# EAGLE design SkyNetV3main-1 (EAGLE 7.1.0)

## Sheet 1 of 4: Controller
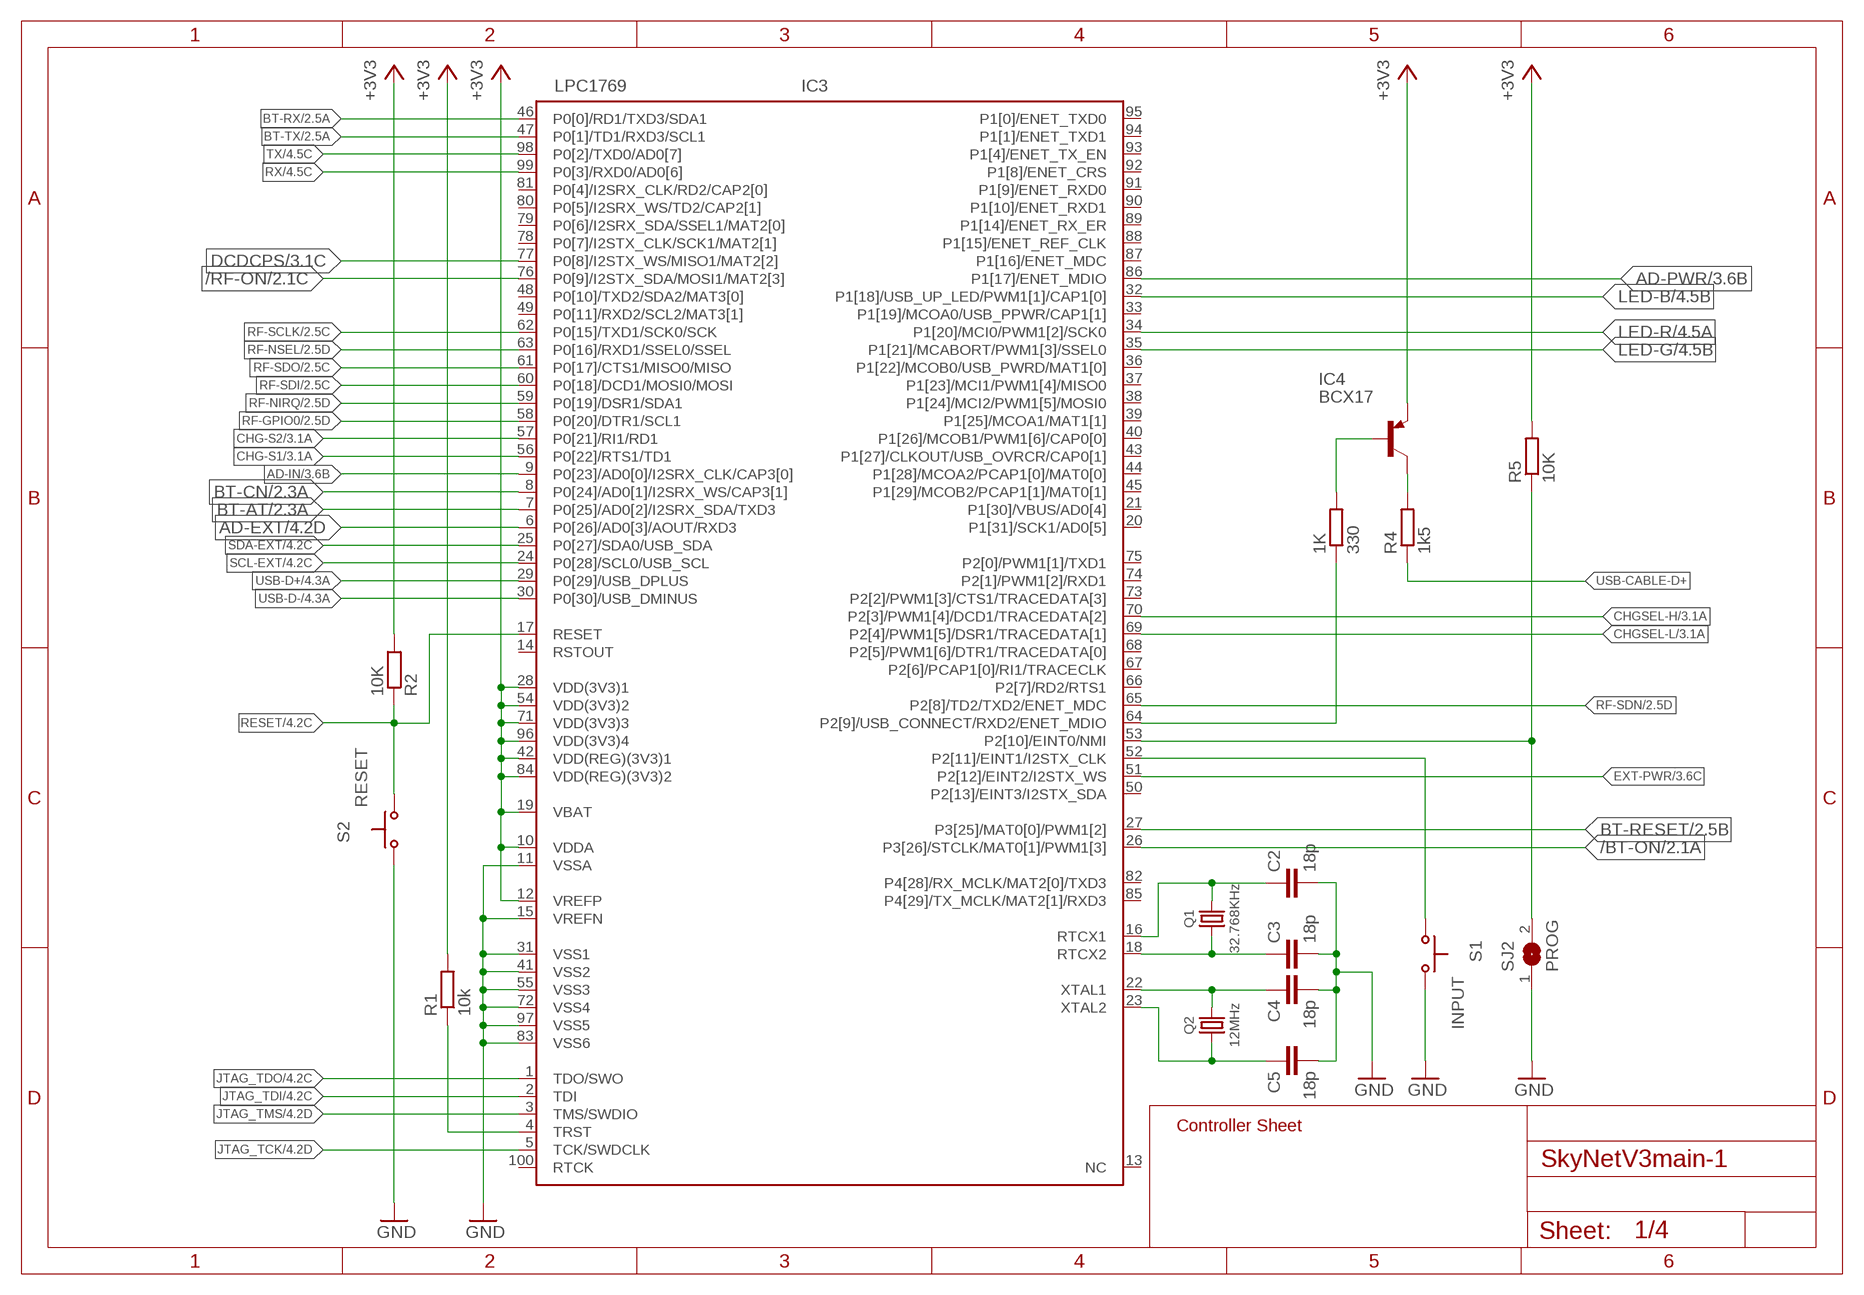
[diagram p0: schematic, sheet 1]

### Parts
1K  330  R-EU_R0603  [R0603]
C2  18p  C-EUC0603  [C0603]
C3  18p  C-EUC0603  [C0603]
C4  18p  C-EUC0603  [C0603]
C5  18p  C-EUC0603  [C0603]
IC3  LPC1769  LPC1768  [LQFP100-14X14]
IC4  BCX17  [SOT23]
Q1  32.768KHz  XTAL2-PAD  [XTAL_49_18]
Q2  12MHz  XTAL4-PAD  [XTAL_50_32]
R1  10k  R-EU_R0603  [R0603]
R2  10K  R-EU_R0603  [R0603]
R4  1k5  R-EU_R0603  [R0603]
R5  10K  R-EU_R0603  [R0603]
S1  INPUT  PTS645SSMTR  [PTS645-SMD]
S2  RESET  PTS645SSMTR  [PTS645-SMD]
SJ2  PROG  SJ  [SJ]

### Nets
+3V3: IC3.10(VDDA) IC3.12(VREFP) IC3.19(VBAT) IC3.28(VDD(3V3)1) IC3.42(VDD(REG)(3V3)1) IC3.54(VDD(3V3)2) IC3.71(VDD(3V3)3) IC3.84(VDD(REG)(3V3)2) IC3.96(VDD(3V3)4) IC4.2(E) R1.2 R2.2 R5.2 ; also sheet 2,3,4
/BT-ON: IC3.26(P3[26]/STCLK/MAT0[1]/PWM1[3]) ; also sheet 2
/RF-ON: IC3.76(P0[9]/I2STX_SDA/MOSI1/MAT2[3]) ; also sheet 2
AD-EXT: IC3.6(P0[26]/AD0[3]/AOUT/RXD3) ; also sheet 4
AD-IN: IC3.9(P0[23]/AD0[0]/I2SRX_CLK/CAP3[0]) ; also sheet 3
AD-PWR: IC3.86(P1[17]/ENET_MDIO) ; also sheet 3
BT-AT: IC3.7(P0[25]/AD0[2]/I2SRX_SDA/TXD3) ; also sheet 2
BT-CN: IC3.8(P0[24]/AD0[1]/I2SRX_WS/CAP3[1]) ; also sheet 2
BT-RESET: IC3.27(P3[25]/MAT0[0]/PWM1[2]) ; also sheet 2
BT-RX: IC3.46(P0[0]/RD1/TXD3/SDA1) ; also sheet 2
BT-TX: IC3.47(P0[1]/TD1/RXD3/SCL1) ; also sheet 2
CHG-S1: IC3.56(P0[22]/RTS1/TD1) ; also sheet 3
CHG-S2: IC3.57(P0[21]/RI1/RD1) ; also sheet 3
CHGSEL-H: IC3.70(P2[3]/PWM1[4]/DCD1/TRACEDATA[2]) ; also sheet 3
CHGSEL-L: IC3.69(P2[4]/PWM1[5]/DSR1/TRACEDATA[1]) ; also sheet 3
DCDCPS: IC3.77(P0[8]/I2STX_WS/MISO1/MAT2[2]) ; also sheet 3
EXT-PWR: IC3.51(P2[12]/EINT2/I2STX_WS) ; also sheet 3
GND: C2.2 C3.2 C4.2 C5.2 IC3.11(VSSA) IC3.15(VREFN) IC3.31(VSS1) IC3.41(VSS2) IC3.55(VSS3) IC3.72(VSS4) IC3.83(VSS6) IC3.97(VSS5) S1.3(S) S1.4(S) S2.1(P) S2.2(P) SJ2.1 ; also sheet 2,3,4
INPUT: IC3.52(P2[11]/EINT1/I2STX_CLK) S1.1(P) S1.2(P)
JTAG-TRST: IC3.4(TRST) R1.1
JTAG_TCK: IC3.5(TCK/SWDCLK) ; also sheet 4
JTAG_TDI: IC3.2(TDI) ; also sheet 4
JTAG_TDO: IC3.1(TDO/SWO) ; also sheet 4
JTAG_TMS: IC3.3(TMS/SWDIO) ; also sheet 4
LED-B: IC3.32(P1[18]/USB_UP_LED/PWM1[1]/CAP1[0]) ; also sheet 4
LED-G: IC3.35(P1[21]/MCABORT/PWM1[3]/SSEL0) ; also sheet 4
LED-R: IC3.34(P1[20]/MCI0/PWM1[2]/SCK0) ; also sheet 4
PROG: IC3.53(P2[10]/EINT0/NMI) R5.1 SJ2.2
RESET: IC3.17(RESET) R2.1 S2.3(S) S2.4(S) ; also sheet 4
RF-GPIO0: IC3.58(P0[20]/DTR1/SCL1) ; also sheet 2
RF-NIRQ: IC3.59(P0[19]/DSR1/SDA1) ; also sheet 2
RF-NSEL: IC3.63(P0[16]/RXD1/SSEL0/SSEL) ; also sheet 2
RF-SCLK: IC3.62(P0[15]/TXD1/SCK0/SCK) ; also sheet 2
RF-SDI: IC3.60(P0[18]/DCD1/MOSI0/MOSI) ; also sheet 2
RF-SDN: IC3.65(P2[8]/TD2/TXD2/ENET_MDC) ; also sheet 2
RF-SDO: IC3.61(P0[17]/CTS1/MISO0/MISO) ; also sheet 2
RTCX1: C2.1 IC3.16(RTCX1) Q1.2
RTCX2: C3.1 IC3.18(RTCX2) Q1.1
RX: IC3.99(P0[3]/RXD0/AD0[6]) ; also sheet 4
SCL-EXT: IC3.24(P0[28]/SCL0/USB_SCL) ; also sheet 4
SDA-EXT: IC3.25(P0[27]/SDA0/USB_SDA) ; also sheet 4
TX: IC3.98(P0[2]/TXD0/AD0[7]) ; also sheet 4
USB-CABLE-D+: R4.1 ; also sheet 4
USB-CON: 1K.1 IC3.64(P2[9]/USB_CONNECT/RXD2/ENET_MDIO)
USB-CON-TRANS: 1K.2 IC4.1(B)
USB-CON-TRANS-2: IC4.3(C) R4.2
USB-D+: IC3.29(P0[29]/USB_DPLUS) ; also sheet 4
USB-D-: IC3.30(P0[30]/USB_DMINUS) ; also sheet 4
XTAL1: C4.1 IC3.22(XTAL1) Q2.3
XTAL2: C5.1 IC3.23(XTAL2) Q2.1
Unconnected: IC3.13(NC) IC3.14(RSTOUT) IC3.20(P1[31]/SCK1/AD0[5]) IC3.21(P1[30]/VBUS/AD0[4]) IC3.33(P1[19]/MCOA0/USB_PPWR/CAP1[1]) IC3.36(P1[22]/MCOB0/USB_PWRD/MAT1[0]) IC3.37(P1[23]/MCI1/PWM1[4]/MISO0) IC3.38(P1[24]/MCI2/PWM1[5]/MOSI0) IC3.39(P1[25]/MCOA1/MAT1[1]) IC3.40(P1[26]/MCOB1/PWM1[6]/CAP0[0]) IC3.43(P1[27]/CLKOUT/USB_OVRCR/CAP0[1]) IC3.44(P1[28]/MCOA2/PCAP1[0]/MAT0[0]) IC3.45(P1[29]/MCOB2/PCAP1[1]/MAT0[1]) IC3.48(P0[10]/TXD2/SDA2/MAT3[0]) IC3.49(P0[11]/RXD2/SCL2/MAT3[1]) IC3.50(P2[13]/EINT3/I2STX_SDA) IC3.66(P2[7]/RD2/RTS1) IC3.67(P2[6]/PCAP1[0]/RI1/TRACECLK) IC3.68(P2[5]/PWM1[6]/DTR1/TRACEDATA[0]) IC3.73(P2[2]/PWM1[3]/CTS1/TRACEDATA[3]) IC3.74(P2[1]/PWM1[2]/RXD1) IC3.75(P2[0]/PWM1[1]/TXD1) IC3.78(P0[7]/I2STX_CLK/SCK1/MAT2[1]) IC3.79(P0[6]/I2SRX_SDA/SSEL1/MAT2[0]) IC3.80(P0[5]/I2SRX_WS/TD2/CAP2[1]) IC3.81(P0[4]/I2SRX_CLK/RD2/CAP2[0]) IC3.82(P4[28]/RX_MCLK/MAT2[0]/TXD3) IC3.85(P4[29]/TX_MCLK/MAT2[1]/RXD3) IC3.87(P1[16]/ENET_MDC) IC3.88(P1[15]/ENET_REF_CLK) IC3.89(P1[14]/ENET_RX_ER) IC3.90(P1[10]/ENET_RXD1) IC3.91(P1[9]/ENET_RXD0) IC3.92(P1[8]/ENET_CRS) IC3.93(P1[4]/ENET_TX_EN) IC3.94(P1[1]/ENET_TXD1) IC3.95(P1[0]/ENET_TXD0) IC3.100(RTCK)

### Notes on the sheet
- Controller Sheet

## Sheet 2 of 4: Radio
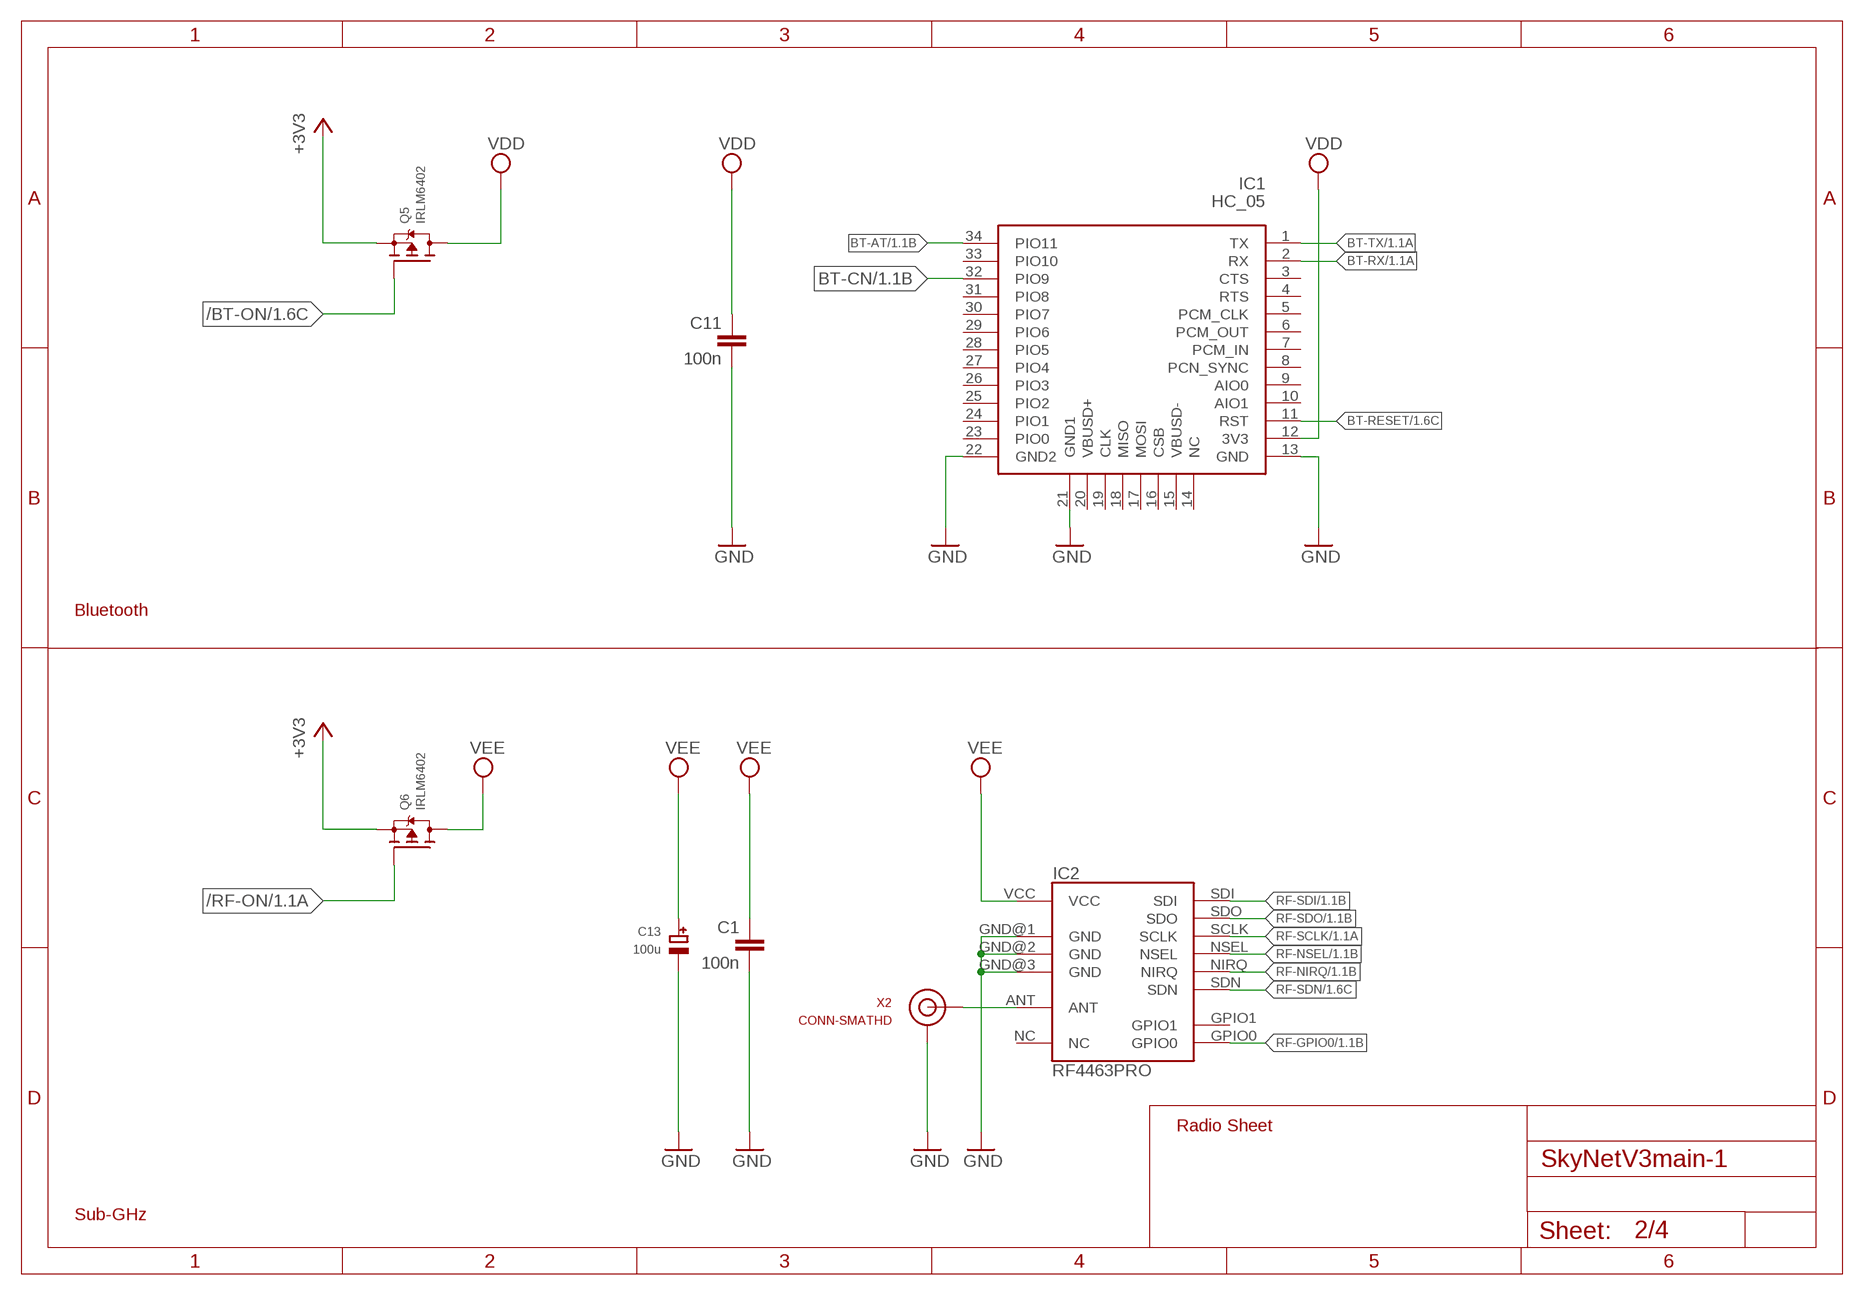
[diagram p1: schematic, sheet 2]

### Parts
C1  100n  C-EUC1206K  [C1206K]
C11  100n  C-EUC1206K  [C1206K]
C13  100u  CAP_TANTALUMC/6032_WAVE  [EIA6032-28/C-W]
IC1  HC_05  [BLUETOOTH_SMD]
IC2  RF4463PRO  [STD_BOARD]
Q5  IRLM6402  MOSFET-PWIDE  [SOT23-WIDE]
Q6  IRLM6402  MOSFET-PWIDE  [SOT23-WIDE]
X2  CONN-SMATHD  [SMA-THD]

### Nets
+3V3: Q5.2(S) Q6.2(S) ; also sheet 1,3,4
/BT-ON: Q5.1(G) ; also sheet 1
/RF-ON: Q6.1(G) ; also sheet 1
ANT: IC2.ANT X2.SIG(SIGNAL)
BT-AT: IC1.34(PIO11) ; also sheet 1
BT-CN: IC1.32(PIO9) ; also sheet 1
BT-RESET: IC1.11(RST) ; also sheet 1
BT-RX: IC1.2(RX) ; also sheet 1
BT-TX: IC1.1(TX) ; also sheet 1
GND: C1.2 C11.2 C13.- IC1.13(GND) IC1.21(GND1) IC1.22(GND2) IC2.GND@1(GND) IC2.GND@2(GND) IC2.GND@3(GND) X2.GND@0(GND) X2.GND@1(GND) X2.GND@2(GND) X2.GND@3(GND) ; also sheet 1,3,4
RF-GPIO0: IC2.GPIO0 ; also sheet 1
RF-NIRQ: IC2.NIRQ ; also sheet 1
RF-NSEL: IC2.NSEL ; also sheet 1
RF-SCLK: IC2.SCLK ; also sheet 1
RF-SDI: IC2.SDI ; also sheet 1
RF-SDN: IC2.SDN ; also sheet 1
RF-SDO: IC2.SDO ; also sheet 1
VDD: C11.1 IC1.12(3V3) Q5.3(D)
VEE: C1.1 C13.+ IC2.VCC Q6.3(D)
Unconnected: IC1.3(CTS) IC1.4(RTS) IC1.5(PCM_CLK) IC1.6(PCM_OUT) IC1.7(PCM_IN) IC1.8(PCN_SYNC) IC1.9(AIO0) IC1.10(AIO1) IC1.14(NC) IC1.15(VBUSD-) IC1.16(CSB) IC1.17(MOSI) IC1.18(MISO) IC1.19(CLK) IC1.20(VBUSD+) IC1.23(PIO0) IC1.24(PIO1) IC1.25(PIO2) IC1.26(PIO3) IC1.27(PIO4) IC1.28(PIO5) IC1.29(PIO6) IC1.30(PIO7) IC1.31(PIO8) IC1.33(PIO10) IC2.GPIO1 IC2.NC

### Notes on the sheet
- Bluetooth
- Radio Sheet
- Sub-GHz

## Sheet 3 of 4: Power
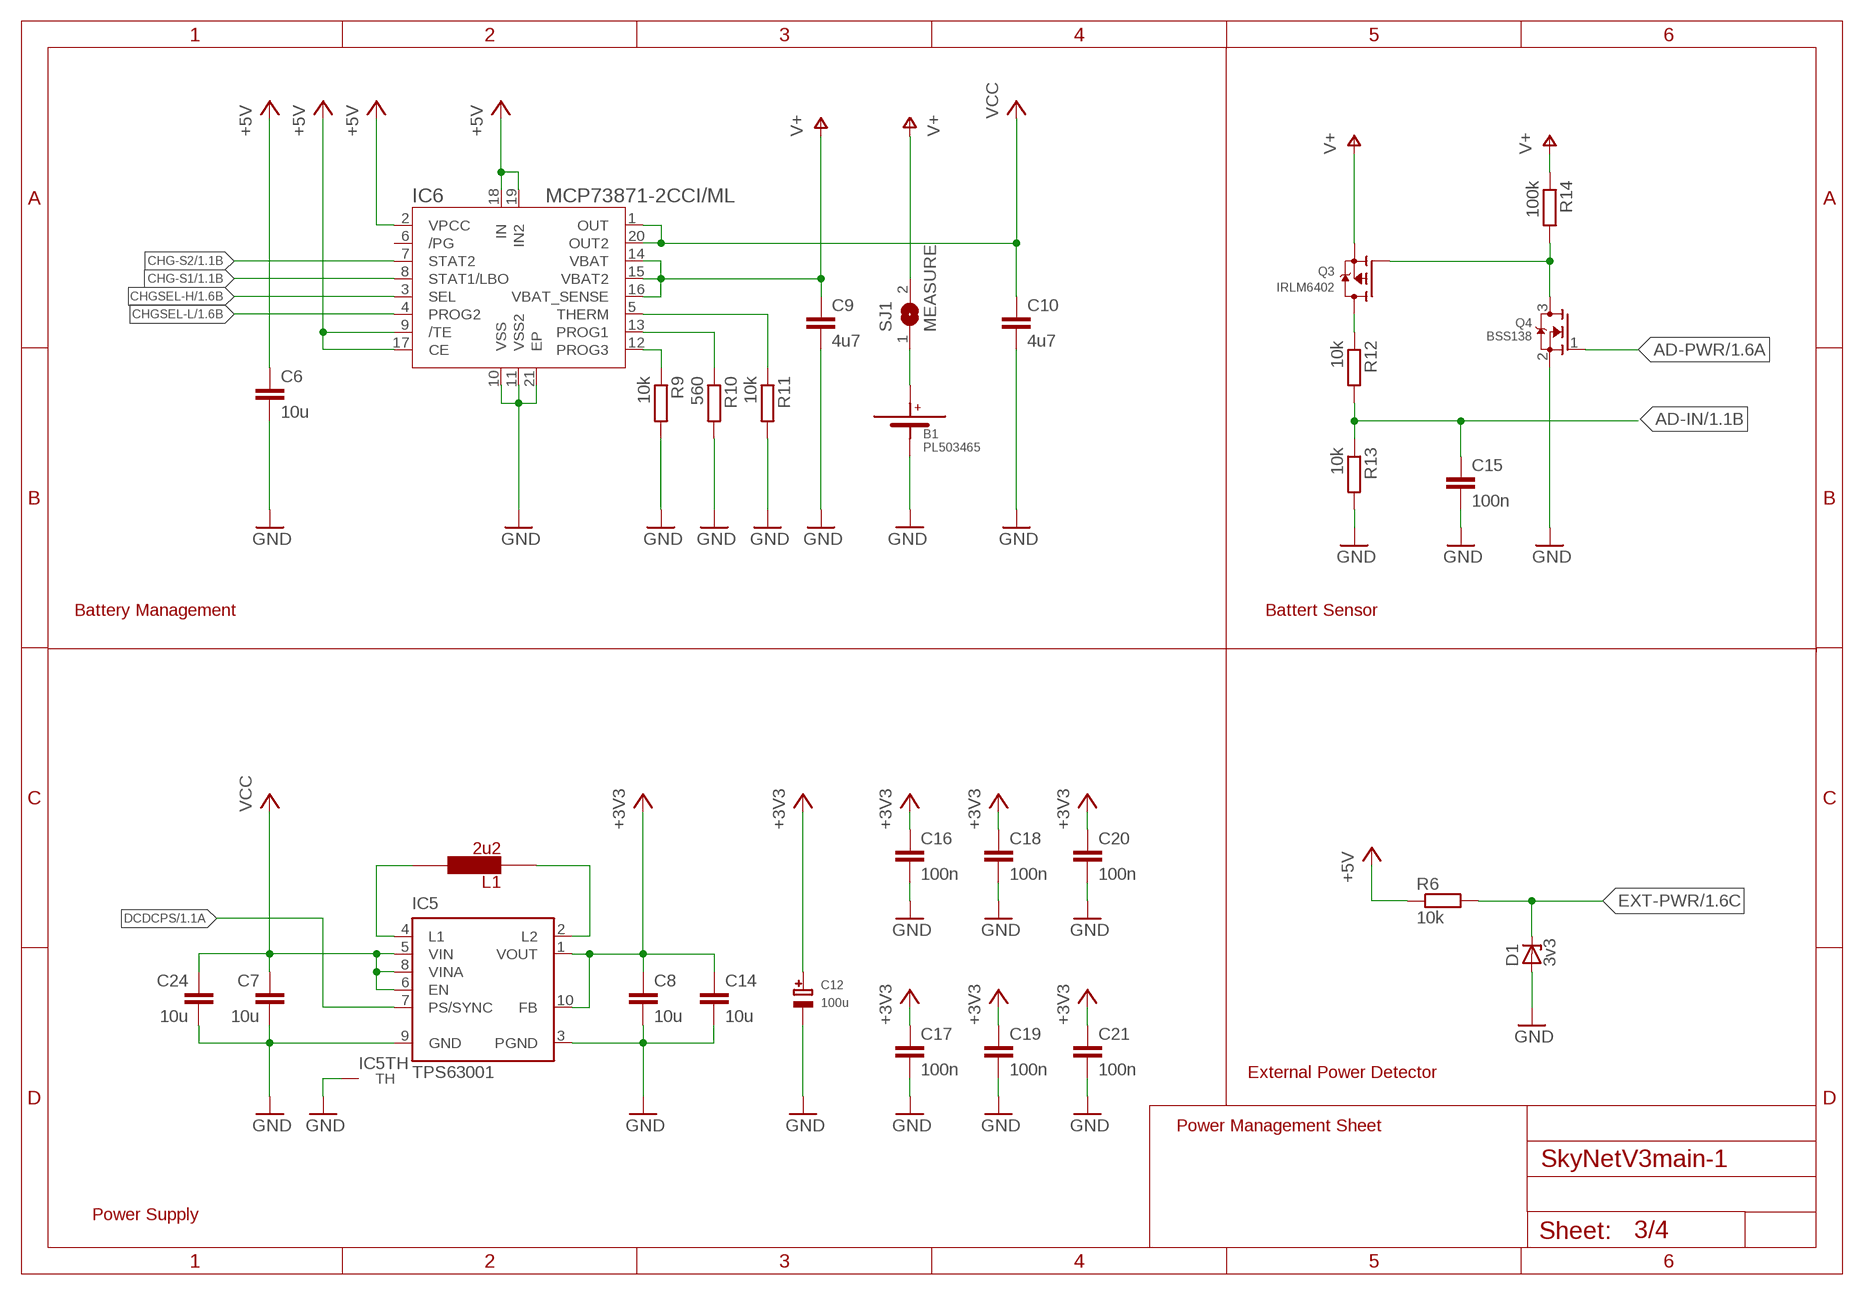
[diagram p2: schematic, sheet 3]

### Parts
B1  PL503465  1S  [PL503465]
C6  10u  C-EUC1206K  [C1206K]
C7  10u  C-EUC1206K  [C1206K]
C8  10u  C-EUC1206K  [C1206K]
C9  4u7  C-EUC1206K  [C1206K]
C10  4u7  C-EUC1206K  [C1206K]
C12  100u  CAP_TANTALUMC/6032_WAVE  [EIA6032-28/C-W]
C14  10u  C-EUC1206K  [C1206K]
C15  100n  C-EUC0603  [C0603]
C16  100n  C-EUC0603  [C0603]
C17  100n  C-EUC0603  [C0603]
C18  100n  C-EUC0603  [C0603]
C19  100n  C-EUC0603  [C0603]
C20  100n  C-EUC0603  [C0603]
C21  100n  C-EUC0603  [C0603]
C24  10u  C-EUC1206K  [C1206K]
D1  3v3  ZENER-DIODESOT23  [SOT23]
IC5  TPS63001  TPS6300  [DRC-S-PVSON-N10]
IC6  MCP73871-2CCI/ML  [QFN20-4X4]
L1  2u2  LPS4012  [LPS4012]
Q3  IRLM6402  MOSFET-PWIDE  [SOT23-WIDE]
Q4  BSS138  MOSFET-NWIDE  [SOT23-WIDE]
R6  10k  R-EU_R0603  [R0603]
R9  10k  R-EU_R0603  [R0603]
R10  560  R-EU_R0603  [R0603]
R11  10k  R-EU_R0603  [R0603]
R12  10k  R-EU_R0603  [R0603]
R13  10k  R-EU_R0603  [R0603]
R14  100k  R-EU_R0603  [R0603]
SJ1  MEASURE  SJ  [SJ]

### Nets
+3V3: C8.1 C12.+ C14.1 C16.1 C17.1 C18.1 C19.1 C20.1 C21.1 IC5.1(VOUT) IC5.10(FB) ; also sheet 1,2,4
+5V: C6.1 IC6.2(VPCC) IC6.9(/TE) IC6.17(CE) IC6.18(IN) IC6.19(IN2) R6.1 ; also sheet 4
AD-IN: C15.1 R12.2 R13.1 ; also sheet 1
AD-PWR: Q4.1(G) ; also sheet 1
AD-PWR-FET: Q3.1(G) Q4.3(D) R14.2
AD-PWR-FET2: Q3.3(D) R12.1
CHG-S1: IC6.8(STAT1/LBO) ; also sheet 1
CHG-S2: IC6.7(STAT2) ; also sheet 1
CHGSEL-H: IC6.3(SEL) ; also sheet 1
CHGSEL-L: IC6.4(PROG2) ; also sheet 1
DCDCPS: IC5.7(PS/SYNC) ; also sheet 1
EXT-PWR: D1.3(C) R6.2 ; also sheet 1
GND: B1.P- C6.2 C7.2 C8.2 C9.2 C10.2 C12.- C14.2 C15.2 C16.2 C17.2 C18.2 C19.2 C20.2 C21.2 C24.2 D1.1(A) IC5.3(PGND) IC5.9(GND) IC5.TH IC6.10(VSS) IC6.11(VSS2) IC6.21(EP) Q4.2(S) R9.2 R10.2 R11.2 R13.2 ; also sheet 1,2,4
L1: IC5.4(L1) L1.1
L2: IC5.2(L2) L1.2
N$2: B1.P+ SJ1.1
PROG1: IC6.13(PROG1) R10.1
PROG3: IC6.12(PROG3) R9.1
THERM: IC6.5(THERM) R11.1
V+: C9.1 IC6.14(VBAT) IC6.15(VBAT2) IC6.16(VBAT_SENSE) Q3.2(S) R14.1 SJ1.2
VCC: C7.1 C10.1 C24.1 IC5.5(VIN) IC5.6(EN) IC5.8(VINA) IC6.1(OUT) IC6.20(OUT2)
Unconnected: IC6.6(/PG)

### Notes on the sheet
- Battery Management | Battert Sensor
- External Power Detector
- Power Management Sheet
- Power Supply

## Sheet 4 of 4: Interface
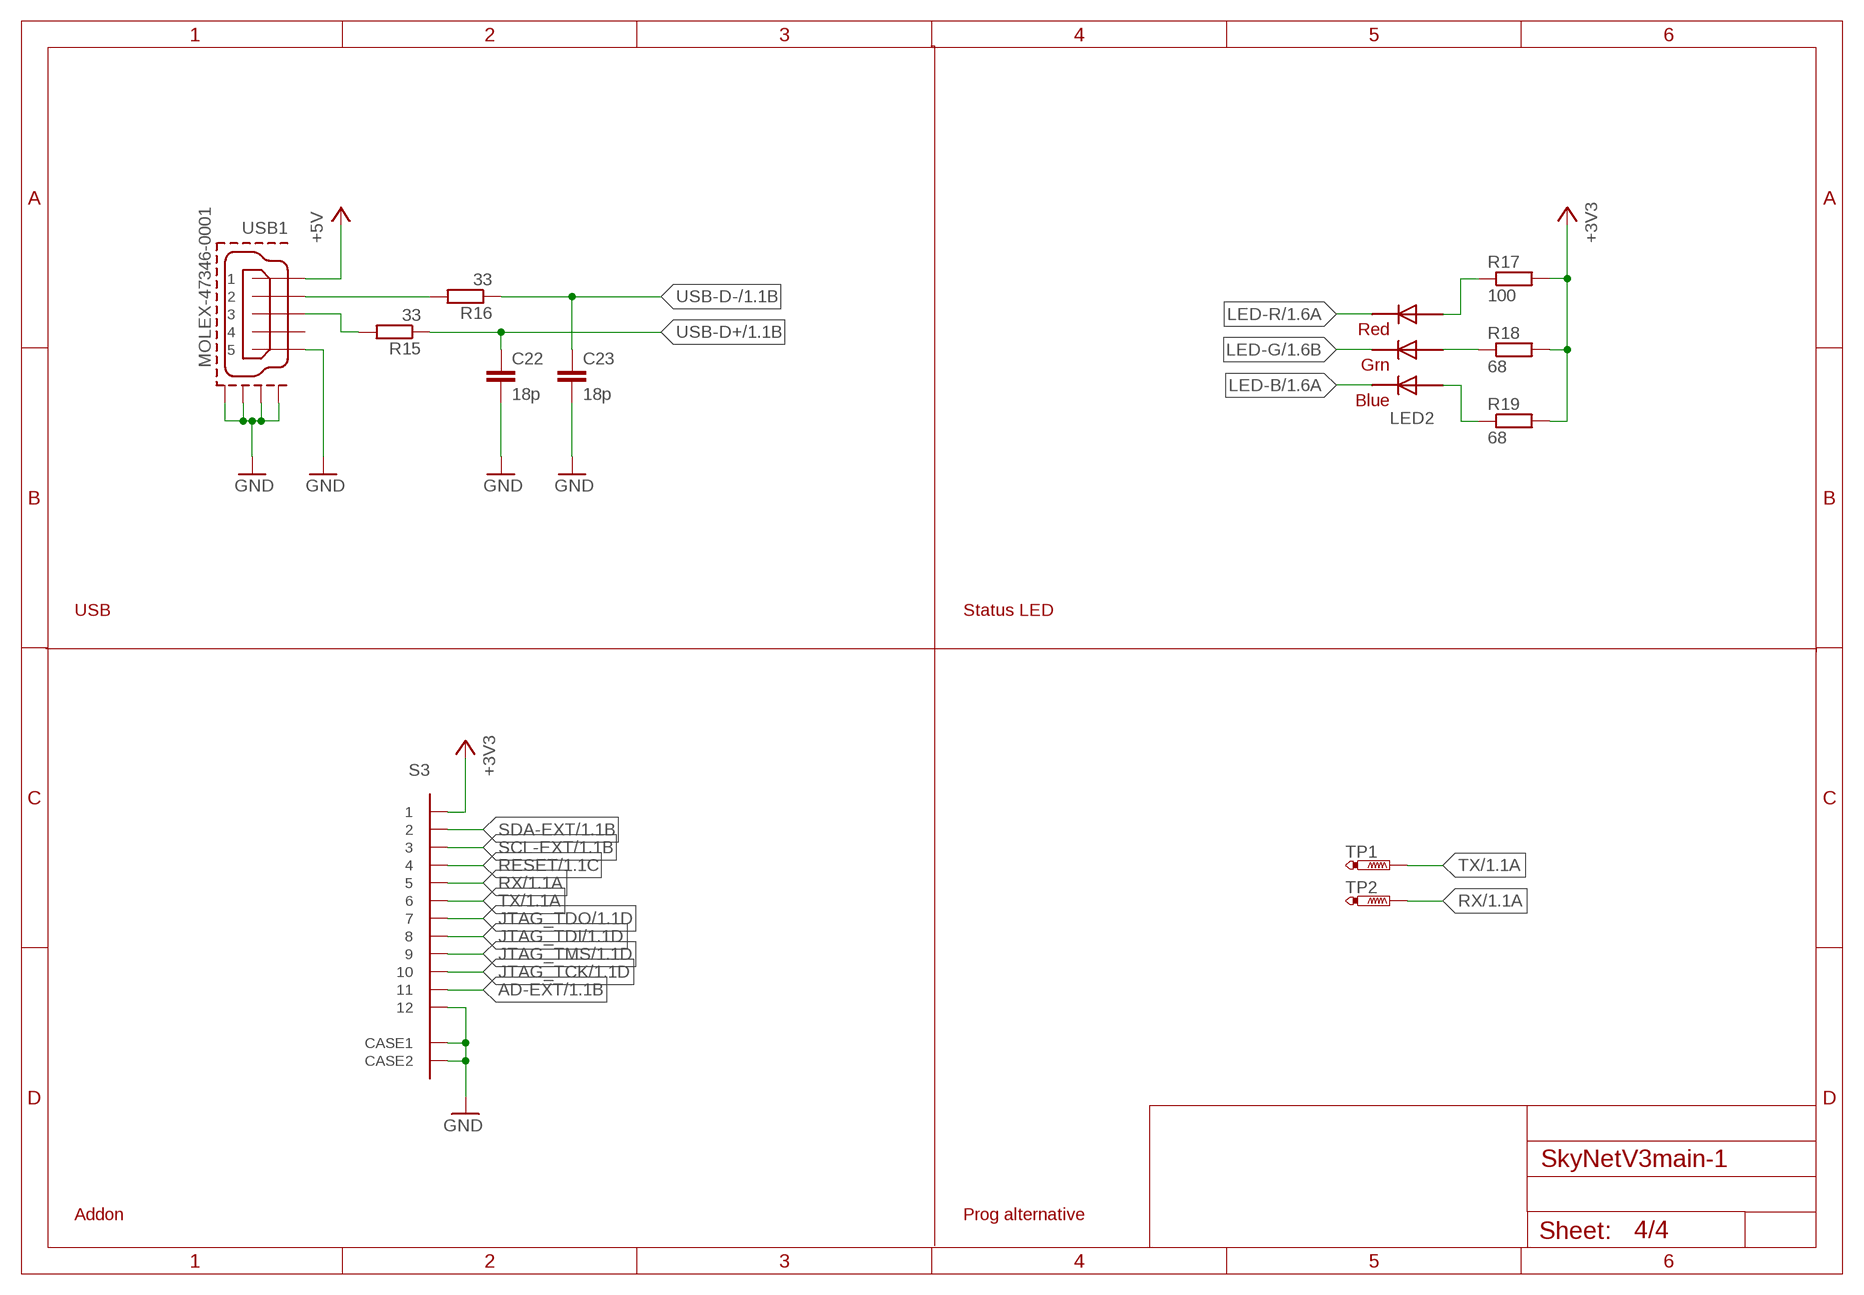
[diagram p3: schematic, sheet 4]

### Parts
C22  18p  C-EUC0603  [C0603]
C23  18p  C-EUC0603  [C0603]
LED2  RGBLED5050  [RGBLED5050]
R15  33  R-EU_R0603  [R0603]
R16  33  R-EU_R0603  [R0603]
R17  100  R-EU_R0603  [R0603]
R18  68  R-EU_R0603  [R0603]
R19  68  R-EU_R0603  [R0603]
S3  MOLEX-52892-1233  [MOLEX-52892-1233]
TP1  PTR1B1,27  [B1,27]
TP2  PTR1B1,27  [B1,27]
USB1  MOLEX-47346-0001  [MOLEX-47364-0001]

### Nets
+3V3: R17.2 R18.2 R19.2 S3.P$1 ; also sheet 1,2,3
+5V: USB1.1 ; also sheet 3
AD-EXT: S3.P$11 ; also sheet 1
GND: C22.2 C23.2 S3.P$12 S3.P$GND1(CASE1) S3.P$GND2(CASE2) USB1.5 USB1.GND1 USB1.GND2 USB1.GND3 USB1.GND4 ; also sheet 1,2,3
JTAG_TCK: S3.P$10 ; also sheet 1
JTAG_TDI: S3.P$8 ; also sheet 1
JTAG_TDO: S3.P$7 ; also sheet 1
JTAG_TMS: S3.P$9 ; also sheet 1
LED-B: LED2.4(BLUE_C) ; also sheet 1
LED-B-R: LED2.3(BLUE_A) R19.1
LED-G: LED2.6(GREEN_C) ; also sheet 1
LED-G-R: LED2.1(GREEN_A) R18.1
LED-R: LED2.5(RED_C) ; also sheet 1
LED-R-R: LED2.2(RED_A) R17.1
RESET: S3.P$4 ; also sheet 1
RX: S3.P$5 TP2.TP ; also sheet 1
SCL-EXT: S3.P$3 ; also sheet 1
SDA-EXT: S3.P$2 ; also sheet 1
TX: S3.P$6 TP1.TP ; also sheet 1
USB-CABLE-D+: R15.2 USB1.3 ; also sheet 1
USB-CABLE-D-: R16.2 USB1.2
USB-D+: C22.1 R15.1 ; also sheet 1
USB-D-: C23.1 R16.1 ; also sheet 1
Unconnected: USB1.4

### Notes on the sheet
- USB | Status LED
- Addon | Prog alternative

## Library data of the parts
1K R1 R2 R4-R6 R9-R19 = rcl:R-EU_: RESISTOR, European symbol
B1 = i7:1S
C1-C11 C14-C24 = rcl:C-EU: CAPACITOR, European symbol
C12 C13 = microbuilder:CAP_TANTALUM: Tantalum Capacitors Wave footprints have larger pads and are meant to be used for hand soldering. Reflow footprints are optimised for solder paste and a reflow oven. EIA3216-18/A-[R/W] - Size A / 3216-18 / 1206 footprint 4.7µF 25V 10% Tantalum Capacitor 10µF 16V 10% Tantalum Capacitor [Digikey: 495-2236-2-ND] EIA3528-21/B-[R/W] - Size B / 3528-21 47µF 10V 10% Tantalum Capactior [Digikey: 495-2216-1-ND] EIA6032-28/C-[R/W] - Size C / 6032-28 10µF 35V 20% Tantalum Capacitor [Digikey: 495-2285-1-ND] 100µF 16V 10% Tantalum Capactior [Digikey: 399-5214-1-ND]
D1 = diode:ZENER-DIODE: Z-Diode
IC1 = Bluetooth HC-05:HC_05: HC-05 Bluetooth Module
IC2 = RF4436PRO:RF4463PRO: RF4463PRO module with Si4463 chipset.
IC3 = lpc1xxx-v6:LPC1768: LPC1768 100 MHz 32-bit ARM Cortex-M3 based microcontroller featuring a high level of integration and low power consumption. 512 kB Flash, 64 kB SRAM, USB Device/Host/OTG, 2 CAN, DAC, Ethernet MarcVl - Datasheet available on www.nxp.com
IC4 = skynet_other:BCX17
IC5 = texas:TPS6300*: HIGH EFFICIENT SINGLE INDUCTOR BUCK-BOOST CONVERTER WITH 1.8-A SWITCHES Source: http://focus.ti.com/lit/ds/symlink/tps63001.pdf; MPN: TPS63000DRCTG4; OC_FARNELL: 1511852; OC_NEWARK: 59M7217
IC6 = microchip-battery:MCP73871: Stand-Alone System Load Sharing and Li-Ion / Li-Polymer Battery Charge Managemen The MCP73871 device is a 1A fully integrated linear solution for system load sharing and Li-Ion / Li-Polymer battery charge management with AC-DC wall adapter and USB port power sources selection. It?s also capable of autonomous power source selection between input or battery. The MCP73871 device employs a constant current/constant voltage (CC/CV) charge algorithm with selectable charge termination point. The constant voltage regulation is fixed with four available options: 4.10V, 4.20V, 4.35V, or 4.40V.; LBO: 3.1 V; SAFETYTIMER: 6 Hours; VREG: 4.20V
L1 = skynet_other:LPS4012
LED2 = adafruit:RGBLED: For 5050 RGB LEDs, the order of the LEDs may vary from one manufacturer to another!
Q1 Q2 = skynet_other:XTAL
Q3 Q5 Q6 = microbuilder:MOSFET-P: P-Channel Mosfet LEGEND VDS: Voltage Drain-Source ID: Drain Current RDS(ON): Drain-Source On-State Resistance VGS(TH): Gate-Source Threshold Voltage CISS: Drain-Source Input Capacitance SOT-23 Name VDS ID RDS(ON) VGS(TH) CISS Order Number IRLML5103 30V 760mA 600 mOhm -- 75pF @ 25V Digikey: IRLML5103PBFCT-ND IRLML6401 12V 4.3A 50 mOhm 950mV @ 250µA 830pF @ 10V Digikey: IRLML6401PBFTR-ND NTR0202PL 20V 400mA 800 mOhm 2.3V @ 250uA 70pF @ 5V Digikey: NTR0202PLT1GOSTR-ND NTR4101PT1G 20V 1.8A 85 mOhm 1.2V @ 250uA 675pF @ 10V Digikey: NTR4101PT1GOSCT-ND DMP2004K 20V 600mA 900 mOhm 1V @ 250uA 175pF @ 16V Digikey: DMP2004KDICT-ND PMV65XP 20V 3.9A 76 mOhm 950mV @ 1mA 725pF @ 20V Digikey: 568-2358-2-ND TO-252 Name VDS ID RDS(ON) VGS(TH) CISS Order Number AOD417 30V 25A 34 mOhm 3V @ 250µA 920pF @ 15V Digikey: 785-1106-2-ND
Q4 = microbuilder:MOSFET-N: N-Channel Mosfet LEGEND VDS: Voltage Drain-Source ID: Drain Current RDS(ON): Drain-Source On-State Resistance VGS(TH): Gate-Source Threshold Voltage CISS: Drain-Source Input Capacitance SOT-23 Name VDS ID RDS(ON) VGS(TH) CISS Order Number 2N7002E 60V 260mA 2.5 Ohm 2.5V @ 250uA 26.7pF @ 25V 2N7002ET1GOSTR-ND BSH103 30V 850mA 400 mOhm 400mV @ 1mA 83pF @ 24V BSH103,235-ND BSS138 60V 320mA 1.6 Ohm 1.5V @ 250uA 50pF @ 10V Mouser: 771-BSS138PW115 DMN2075U-7 20V 4.2A 38 mOhm 1V @ 250 uA 594.3pF @ 10V DMN2075U-7DICT-ND * BSS138 good choice for I2C level-shifting
S1 S2 = switch-ck:PTS645S???SMTR: TACT SWITCH
S3 = sid:MOLEX-52892-1233
SJ1 SJ2 = jumper:SJ: SMD solder JUMPER
TP1 TP2 = testpad:PTR1: TEST PIN
USB1 = usb_con-update:MOLEX-47346-0001: MICRO USB B, BOTTOM MOUNT
X2 = SteveMarple:CONN-SMA: SMA connector

## Board
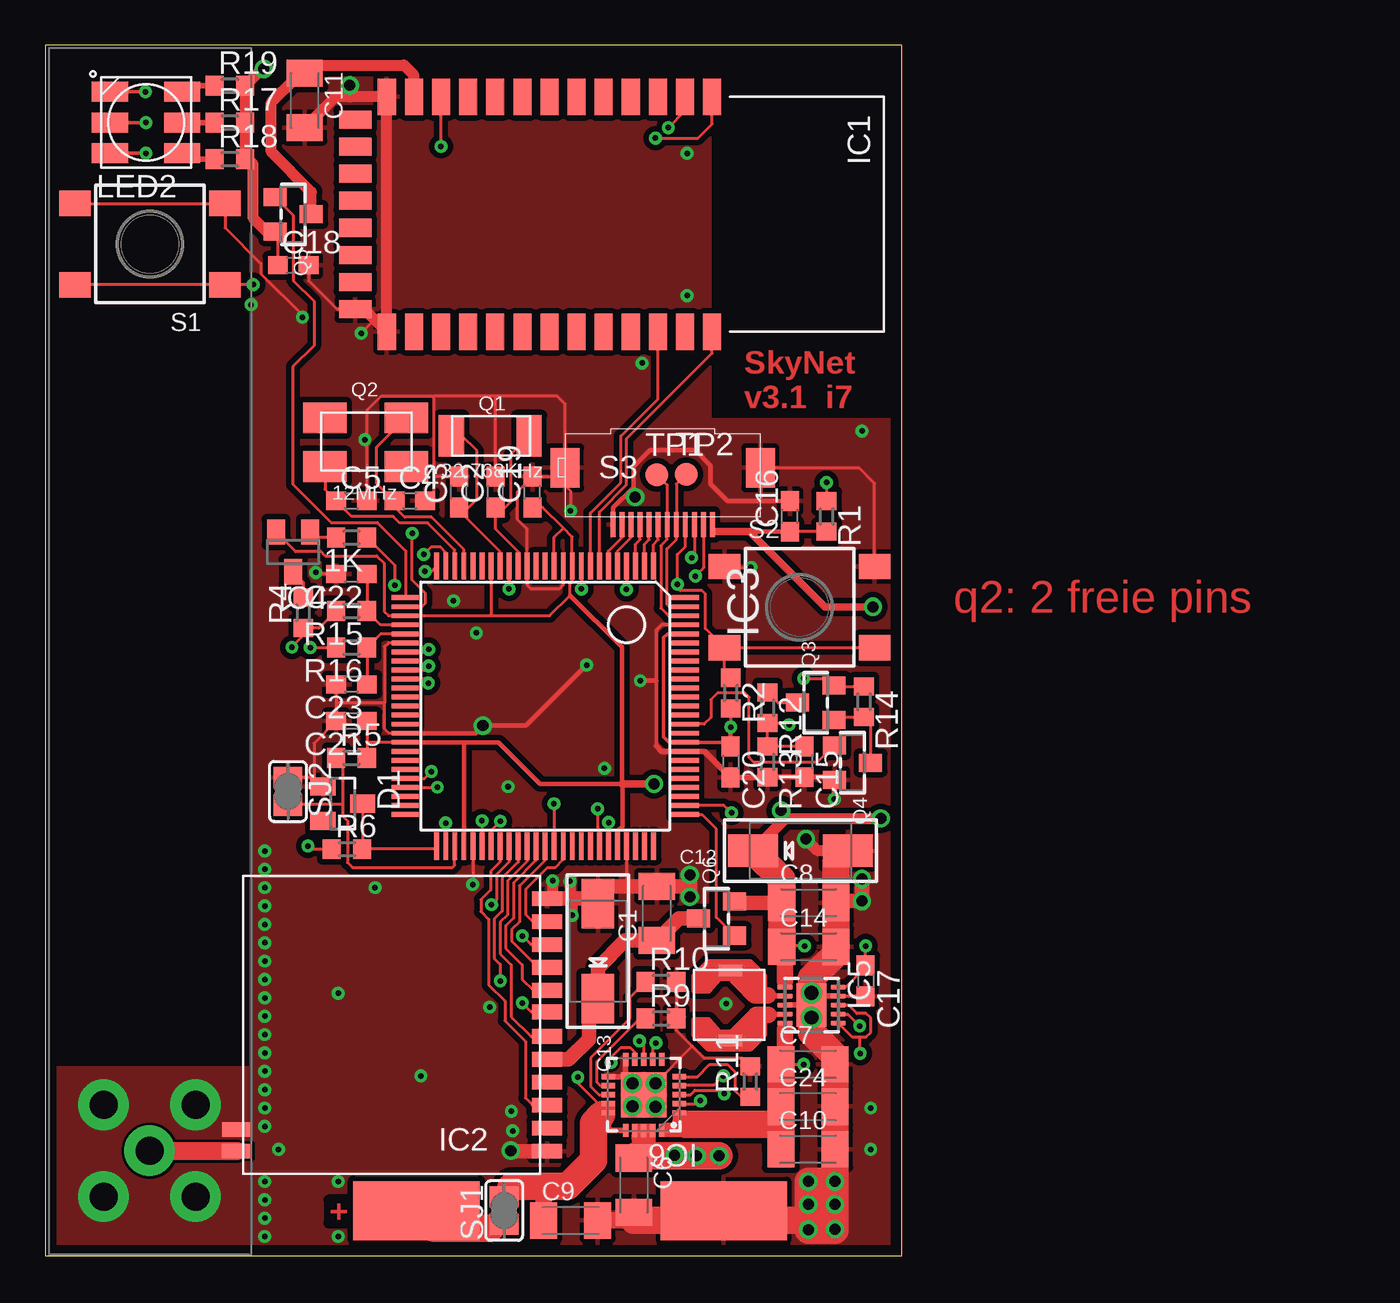
[diagram p4: board, top side]
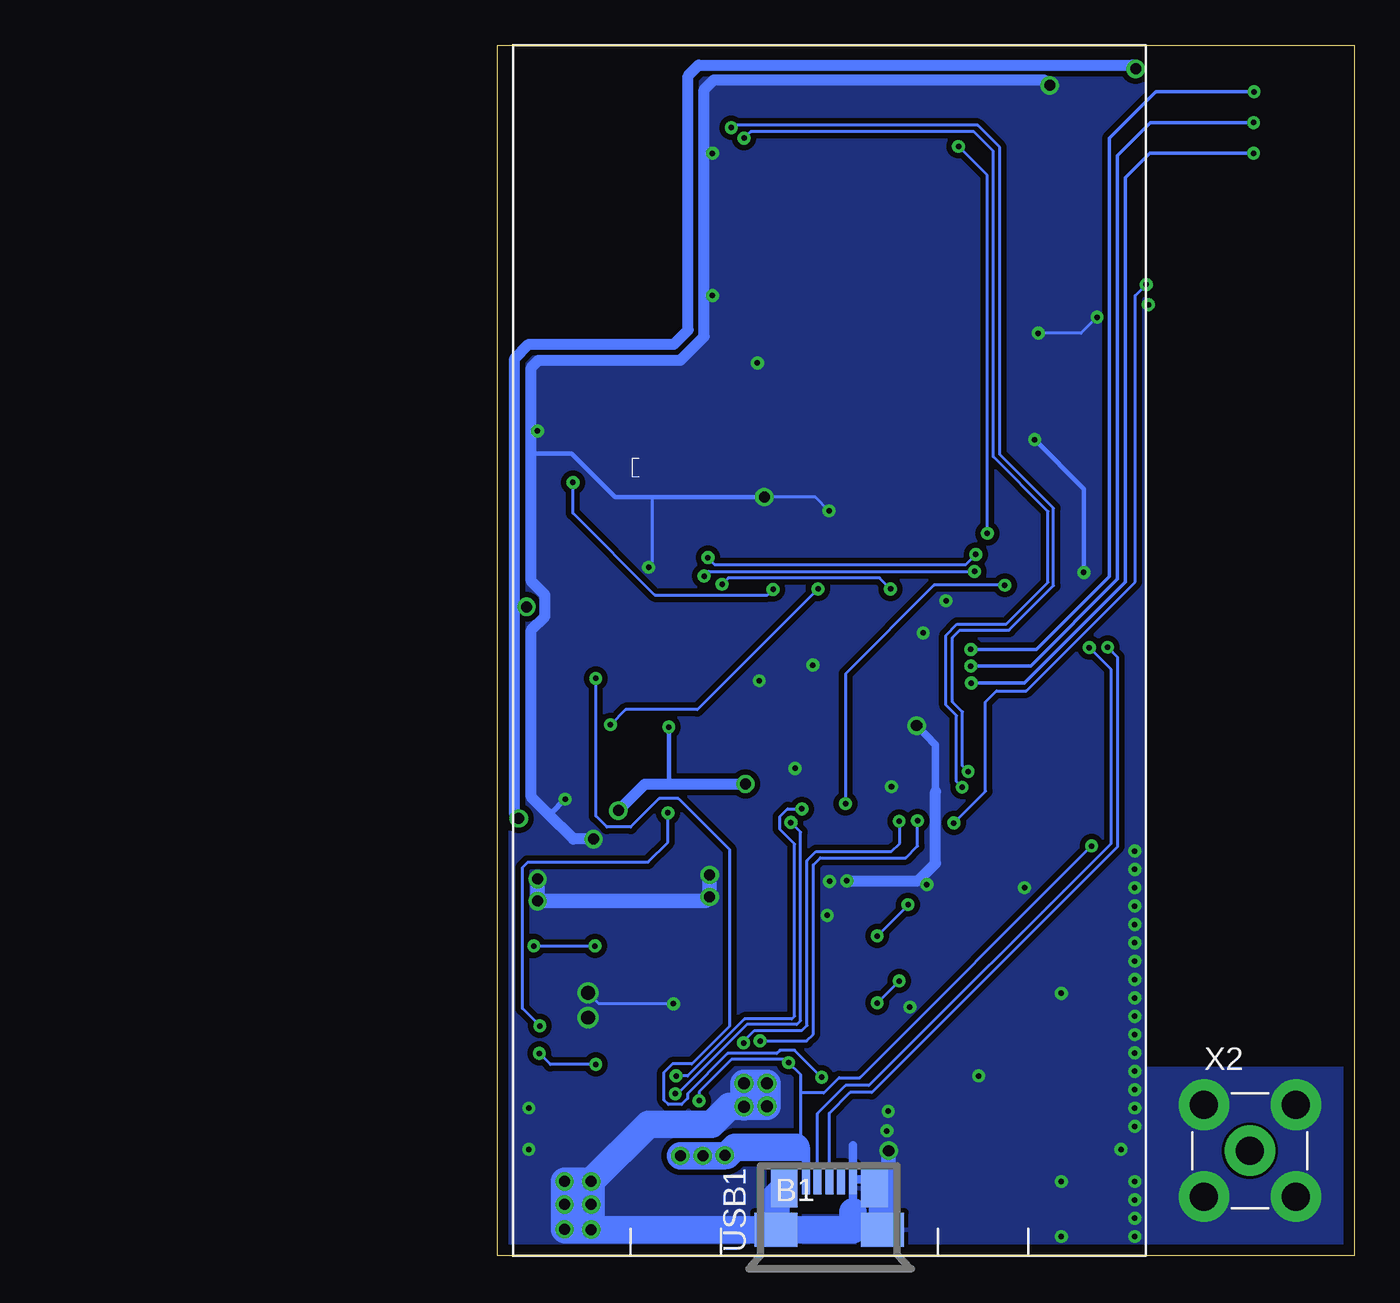
[diagram p5: board, bottom side, seen from below]

Size 47.4 x 67 mm. Coordinates in mm from the lower left corner, seen from the top.
Outline: 0,0 47.4,0 47.4,67 0,67 0,0
Copper layers (1*16): Top 0.035mm / dielectric 1.5mm / Bottom 0.035mm
Design rules "default *": minimum track width 6mil, minimum drill 12mil, track to track 6mil, track to pad 6mil, pad to pad 6mil, via to via 6mil, smd to smd 6mil, copper to edge 24mil, drill to drill 24mil, minimum pad ring 10mil, minimum via ring 8mil, stop-mask expansion 4mil, vias tented up to drill 0mil, thermal gap 10mil

### Footprints (pad centres in the part's own frame; a part is rotated, then mirrored left to right if it is on the bottom)
R0603 = smd 1 x 1.1: 1 -0.85,0; 2 0.85,0
PL503465 = smd 7 x 3.251 bottom: P+ 8.5,2.5; P- -8.5,2.5
C1206K = smd 1.5 x 2: 1 -1.5,0; 2 1.5,0
C0603 = smd 1.1 x 1: 1 -0.85,0; 2 0.85,0
EIA6032-28/C-W = smd 2.75 x 1.8: + 2.625,0; - -2.625,0
SOT23 = smd 1 x 1.4: 1 -0.95,-1.1; 2 0.95,-1.1; 3 0,1.1
BLUETOOTH_SMD = smd 2 x 1: 1 -6.35,3.81; 2 -6.35,2.31; 3 -6.35,0.81; 4 -6.35,-0.69; 5 -6.35,-2.19; 6 -6.35,-3.69; 7 -6.35,-5.19; 8 -6.35,-6.69; 9 -6.35,-8.19; 10 -6.35,-9.69; 11 -6.35,-11.19; 12 -6.35,-12.69; 13 -6.35,-14.19; 22 6.65,-14.19; 23 6.65,-12.69; 24 6.65,-11.19; 25 6.65,-9.69; 26 6.65,-8.19; 27 6.65,-6.69; 28 6.65,-5.19; 29 6.65,-3.69; 30 6.65,-2.19; 31 6.65,-0.69; 32 6.65,0.81; 33 6.65,2.31; 34 6.65,3.81 | smd 1 x 1.8: 14 -5.1,-15.94; 15 -3.6,-15.94; 16 -2.1,-15.94; 17 -0.6,-15.94; 18 0.9,-15.94; 19 2.4,-15.94; 20 3.9,-15.94; 21 5.4,-15.94
STD_BOARD = smd 1.676 x 0.813: ANT 8.811,6.35; GND@1 8.811,5.159; GND@2 -8.334,6.35; GND@3 -8.334,-7.62; GPIO0 -8.334,3.81; GPIO1 -8.334,2.54; NC -8.334,5.08; NIRQ -8.334,-5.08; NSEL -8.334,-3.81; SCLK -8.334,-2.54; SDI -8.334,-1.349; SDN -8.334,-6.35; SDO -8.334,0; VCC -8.334,1.27
LQFP100-14X14 = smd 0.27 x 1.5: 1 -6,-7.75; 2 -5.5,-7.75; 3 -5,-7.75; 4 -4.5,-7.75; 5 -4,-7.75; 6 -3.5,-7.75; 7 -3,-7.75; 8 -2.5,-7.75; 9 -2,-7.75; 10 -1.5,-7.75; 11 -1,-7.75; 12 -0.5,-7.75; 13 0,-7.75; 14 0.5,-7.75; 15 1,-7.75; 16 1.5,-7.75; 17 2,-7.75; 18 2.5,-7.75; 19 3,-7.75; 20 3.5,-7.75; 21 4,-7.75; 22 4.5,-7.75; 23 5,-7.75; 24 5.5,-7.75; 25 6,-7.75; 51 6,7.75; 52 5.5,7.75; 53 5,7.75; 54 4.5,7.75; 55 4,7.75; 56 3.5,7.75; 57 3,7.75; 58 2.5,7.75; 59 2,7.75; 60 1.5,7.75; 61 1,7.75; 62 0.5,7.75; 63 0,7.75; 64 -0.5,7.75; 65 -1,7.75; 66 -1.5,7.75; 67 -2,7.75; 68 -2.5,7.75; 69 -3,7.75; 70 -3.5,7.75; 71 -4,7.75; 72 -4.5,7.75; 73 -5,7.75; 74 -5.5,7.75; 75 -6,7.75 | smd 1.5 x 0.27: 26 7.75,-6; 27 7.75,-5.5; 28 7.75,-5; 29 7.75,-4.5; 30 7.75,-4; 31 7.75,-3.5; 32 7.75,-3; 33 7.75,-2.5; 34 7.75,-2; 35 7.75,-1.5; 36 7.75,-1; 37 7.75,-0.5; 38 7.75,0; 39 7.75,0.5; 40 7.75,1; 41 7.75,1.5; 42 7.75,2; 43 7.75,2.5; 44 7.75,3; 45 7.75,3.5; 46 7.75,4; 47 7.75,4.5; 48 7.75,5; 49 7.75,5.5; 50 7.75,6; 76 -7.75,6; 77 -7.75,5.5; 78 -7.75,5; 79 -7.75,4.5; 80 -7.75,4; 81 -7.75,3.5; 82 -7.75,3; 83 -7.75,2.5; 84 -7.75,2; 85 -7.75,1.5; 86 -7.75,1; 87 -7.75,0.5; 88 -7.75,0; 89 -7.75,-0.5; 90 -7.75,-1; 91 -7.75,-1.5; 92 -7.75,-2; 93 -7.75,-2.5; 94 -7.75,-3; 95 -7.75,-3.5; 96 -7.75,-4; 97 -7.75,-4.5; 98 -7.75,-5; 99 -7.75,-5.5; 100 -7.75,-6
DRC-S-PVSON-N10 = smd 0.28 x 0.85: 1 -1,-1.475; 2 -0.5,-1.475; 3 0,-1.475; 4 0.5,-1.475; 5 1,-1.475; 6 1,1.475; 7 0.5,1.475; 8 0,1.475; 9 -0.5,1.475; 10 -1,1.475 | smd 2.4 x 1.65: TH 0,0
QFN20-4X4 = smd 0.73 x 0.3: 1 -1.965,1; 2 -1.965,0.5; 3 -1.965,0; 4 -1.965,-0.5; 5 -1.965,-1; 11 1.965,-1; 12 1.965,-0.5; 13 1.965,0; 14 1.965,0.5; 15 1.965,1 | smd 0.3 x 0.73: 6 -1,-1.965; 7 -0.5,-1.965; 8 0,-1.965; 9 0.5,-1.965; 10 1,-1.965; 16 1,1.965; 17 0.5,1.965; 18 0,1.965; 19 -0.5,1.965; 20 -1,1.965 | smd 2.5 x 2.5: 21 0,0
LPS4012 = smd 0.635 x 1.27: 1 -2.035,-0.225; 2 1.845,-0.225
RGBLED5050 = smd 2 x 1.1: 1 -2,1.7; 2 -2,0; 3 -2,-1.7; 4 2,-1.7; 5 2,0; 6 2,1.7
XTAL_49_18 = smd 1.4 x 2.3: 1 -2.25,0.1; 2 2.05,0.1
XTAL_50_32 = smd 2.4 x 1.7: 1 -2.248,-1.5; 2 2.252,-1.5; 3 2.252,1.19; 4 -2.248,1.19
SOT23-WIDE = smd 1 x 1.27: 1 -0.95,-1; 2 0.95,-1; 3 0,1
PTS645-SMD = smd 1.75 x 1.4: 1 -4.15,2.25; 2 4.15,2.25; 3 -4.15,-2.25; 4 4.15,-2.25
MOLEX-52892-1233 = smd 1.4 x 0.27: P$1 0,2.5; P$2 0,2; P$3 0,1.5; P$4 0,1; P$5 0,0.5; P$6 0,0; P$7 0,-0.5; P$8 0,-1; P$9 0,-1.5; P$10 0,-2; P$11 0,-2.5; P$12 0,-3 | smd 2.2 x 1.6: P$GND1 -3.15,5.15; P$GND2 -3.15,-5.65
SJ = smd 1.168 x 1.6: 1 -0.762,0; 2 0.762,0
B1,27 = smd 1.27 x 1.27: TP 0,0
MOLEX-47364-0001 = smd 1.7 x 0.45: 1 2.8,1.3; 2 2.8,0.65; 3 2.8,0; 4 2.8,-0.65; 5 2.8,-1.3 | smd 1.9 x 2.375: GND1 0,2.95; GND4 0,-2.95 | smd 2.1 x 1.475: GND2 2.3,2.5; GND3 2.3,-2.5
SMA-THD = drill 1.549 pad 2.794: GND@0 -2.54,2.54; GND@1 2.54,2.54; GND@2 2.54,-2.54; GND@3 -2.54,-2.54; SIG 0,0

### Placement (x,y rotation side)
1K  16.95,39.76 180 top
B1  29.04,0.01 0 bottom
C1  33.84,18.95 90 top
C2  24.93,42.27 90 top
C3  22.9,42.27 90 top
C4  20.18,41.79 0 top
C5  16.95,41.79 0 top
C6  32.57,3.92 270 top
C7  42.21,10.6 0 top
C8  42.26,19.55 0 top
C9  29.07,1.96 0 top
C10  42.21,5.9 0 top
C11  14.36,63.94 270 top
C12  41.79,22.43 180 top
C13  30.58,16.87 270 top
C14  42.26,17.11 0 top
C15  42,27.34 270 top
C16  41.21,40.93 90 top
C17  45.4,15.22 270 top
C18  13.73,54.82 0 top
C19  26.96,42.27 90 top
C20  37.93,27.34 270 top
C21  16.95,29.6 180 top
C22  16.95,37.73 180 top
C23  16.95,31.63 180 top
C24  42.21,8.27 0 top
D1  16.47,25.03 270 top
IC1  33.1,57.79 270 top
IC2  19.44,12.15 180 top
IC3  27.67,30.43 180 top
IC4  13.72,38.96 180 top
IC5  42.41,13.88 270 top
IC6  33.12,8.92 180 top
L1  37.69,13.96 90 top
LED2  5.59,62.72 180 top
Q1  24.73,45.28 0 top
Q2  17.73,45.19 0 top
Q3  42.64,30.62 90 top
Q4  44.67,27.29 270 top
Q5  13.73,57.64 270 top
Q6  37.15,18.68 90 top
R1  43.24,40.93 270 top
R2  37.93,31.15 270 top
R4  14.29,35.59 90 top
R5  16.95,27.57 0 top
R6  16.7,22.51 0 top
R9  34.07,13.14 0 top
R10  34.07,15.17 0 top
R11  39.01,9.65 90 top
R12  39.97,30.34 270 top
R13  39.97,27.34 270 top
R14  45.31,30.67 270 top
R15  16.95,35.69 180 top
R16  16.95,33.66 180 top
R17  10.22,62.72 0 top
R18  10.22,60.69 0 top
R19  10.22,64.75 0 top
S1  5.8,55.99 180 top
S2  41.74,35.9 0 top
S3  34.42,40.47 270 top
SJ1  25.4,2.51 90 top
SJ2  13.43,25.7 270 top
TP1  33.84,43.24 0 top
TP2  35.47,43.26 0 top
USB1  29.05,1.45 90 bottom
X2  5.78,5.82 0 bottom

### Tracks (layer width: path | path; a pad name or v marks a point on that pad's centre or on a via)
+3V3  (via drill 0.3, 0.61)
  Top 0.152: v45.4,17.15 C17.1 45.4,15.98 44.3,14.88 IC5.10 | v42.02,17.15 40.8,17.15 C14.1 | C21.1 17.8,28.43 | 17.8,28.43 R5.2 | IC3.42 17.8,28.43 | R2.2 v37.93,29.27 | Q5.2 12.88,56.54 C18.1 | R1.2 C16.1 | 28.68,40.28 29.17,39.79 IC3.10 29.17,37.32 29.04,37.19 29.04,36.56 27.91,35.43 24.62,35.43 | 28.68,40.28 27.53,41.42 C19.1 | IC3.12 28.17,39.77 28.68,40.28 | IC4.2 13.85,38.97 15.28,38.97 15.51,38.74 18.35,38.74 18.76,38.34 18.76,35.67 19,35.43 IC3.28 24.62,35.43 | IC3.19 24.67,35.47 24.62,35.43
  Top 0.203: C20.1 37.69,28.43 IC3.84 34.5,28.43 34.23,28.71 34.23,34.22 34.43,34.43 IC3.96
  Top 0.254: IC5.1 40.94,15.42 40.93,15.2 | C20.1 v37.93,29.27 | S3.P$1 36.92,40.08 37.15,40.08 | 37.15,40.08 C16.1 | IC3.42 23.13,28.43 | 23.13,28.43 25.08,28.43 27.39,26.12 31.91,26.12 | IC3.71 31.67,23.51 31.94,23.78 31.94,26.09 31.91,26.12 | IC3.54 23.17,28.38 23.13,28.43 | 37.15,40.08 37.15,40.09 | 29.04,36.56 31.91,33.69 31.91,26.12
  Top 0.406: 31.91,26.12 v33.69,26.12 | 37.15,40.09 38.97,40.09 43.14,35.92 v45.81,35.92
  Top 0.61: C12.+ 40.96,24.21 | 40.96,24.21 v46.24,24.21 | v12.1,65.69 12.01,65.69 R19.2 R17.2 R18.2 11.24,60.69 11.49,60.43 11.49,57.46 12.26,56.69 Q5.2 | 40.96,24.21 40.96,24.42 v40.73,24.64
  Top 0.813: Q6.2 38.23,19.55 C8.1
  Top 0.914: 40.93,15.2 40.93,17.11 C14.1
  Top 1.524: C14.1 C8.1 40.76,20.84 C12.+
  Bottom 0.152: v45.4,17.15 v42.02,17.15 | 37.93,26.19 37.86,26.12
  Bottom 0.254: v37.93,29.27 37.93,26.19
  Bottom 0.406: v45.81,35.92 46.42,35.92 46.47,35.97
  Bottom 0.61: v46.24,24.21 46.47,24.44 46.47,35.97 46.47,49.66 45.68,50.45 37.65,50.45 36.87,51.24 36.87,65.31 36.28,65.89 12.3,65.89 v12.1,65.69 | v40.73,24.64 39.25,26.12 37.86,26.12 v33.69,26.12
+5V  (via drill 0.3, 0.61)
  Top 0.152: IC6.2 36.09,8.42 v36.26,8.59 | IC6.9 32.63,11.28 32.4,11.51 31.84,11.51 31.3,10.98 v31.3,10.7 | v14.54,22.69 14.72,22.51 R6.1
  Top 0.305: 33.11,6.59 33.13,6.59 IC6.18 IC6.19 33.63,7.17 32.62,7.17 IC6.17
  Top 1.321: 33.11,6.59 33.11,5.77
  Top 1.524: 33.11,5.77 C6.1 32.7,5.54 v37.3,5.54
  Bottom 0.152: v36.26,8.59 36.26,9.07 34.43,10.9 31.51,10.9 v31.3,10.7 30.64,10.04 30.64,9.02 | 30.64,9.02 30.64,6 30.65,5.99 30.79,5.99 | 30.64,9.02 29.35,9.02 28.51,9.86 27.37,9.86 v14.54,22.69
  Bottom 0.305: 31.33,5.52 31.2,5.39 30.36,5.39 30.36,5.96 30.35,5.96
  Bottom 0.457: USB1.1 30.35,5.96 30.79,5.99 30.9,6
  Bottom 1.524: 30.9,6 34.28,6 34.71,5.57 v34.83,5.57 34.89,5.57 34.91,5.54 v36.05,5.54 v37.3,5.54
/BT-ON
  Top 0.152: Q5.1 13.73,57.59 13.73,53.98 14.87,52.84 14.87,50.37 13.7,49.21 13.7,42.7 15.81,40.6 18.38,40.6 19.95,39.02 19.95,36.46 IC3.26
/RF-ON
  Top 0.152: Q6.1 37.15,18.73 37.15,23.63 36.35,24.43 IC3.76
AD-EXT
  Top 0.152: IC3.6 31.17,39.01 31.92,39.77 S3.P$11
AD-IN  (via drill 0.3)
  Top 0.152: C15.1 R13.1 R12.2 41.06,29.49 v41.16,29.39 | IC3.9 29.67,36.92 v29.68,36.91
  Bottom 0.152: v29.68,36.91 36.36,30.23 40.32,30.23 v41.16,29.39
AD-PWR
  Top 0.152: Q4.1 43.64,28.24 42.72,27.32 39.22,27.32 38.95,27.59 38.95,30.92 38.72,31.15 37.2,31.15 36.84,30.79 36.84,29.8 36.47,29.43 IC3.86 35.43,29.42
AD-PWR-FET
  Top 0.152: Q3.1 43.79,29.82 R14.2 45.67,29.46 Q4.3
AD-PWR-FET2
  Top 0.152: R12.1 40.54,30.62 Q3.3
ANT
  Top 0.813: 5.78,5.8 X2.SIG
  Top 0.991: IC2.ANT 5.78,5.8
BT-AT
  Top 0.152: IC3.7 30.67,41.18 32.17,42.68 32.17,45.22 36.91,49.96 IC1.34
BT-CN
  Top 0.152: IC3.8 30.17,41.11 31.86,42.81 31.86,45.37 33.91,47.41 IC1.32
BT-RESET  (via drill 0.3)
  Top 0.152: IC3.27 20.84,35.93 21.04,36.13 21.04,36.66 20.31,37.4 v20.31,39.99 | v21.91,61.4 IC1.11
  Bottom 0.152: v20.31,39.99 20.31,59.8 v21.91,61.4
BT-RX  (via drill 0.3)
  Top 0.152: IC3.46 21,26.43 v21.37,26.8 | v34.48,62.44 35.41,63.37 IC1.2
  Bottom 0.152: v21.37,26.8 21.68,27.11 21.68,30.11 22.24,30.66 22.24,34.22 21.83,34.63 19.11,34.63 16.65,37.09 16.65,41.38 19.62,44.36 19.62,61.35 20.84,62.57 34.35,62.57 v34.48,62.44
BT-TX  (via drill 0.3)
  Top 0.152: IC3.47 21.66,25.93 v21.7,25.94 | v33.77,61.86 36.13,61.86 36.91,62.63 IC1.1
  Bottom 0.152: v21.7,25.94 22.01,26.24 22.01,29.9 22.59,30.49 22.59,34.35 21.98,34.96 19.26,34.96 16.95,37.27 16.95,41.21 19.98,44.23 19.98,61.14 21.04,62.21 33.41,62.21 v33.77,61.86
CHG-S1  (via drill 0.3)
  Top 0.152: IC6.8 33.13,11.65 v32.88,11.89 | v24.17,24.09 IC3.56
  Bottom 0.152: v32.88,11.89 30.31,11.89 29.93,12.27 29.93,21.65 29.55,22.03 24.82,22.03 IC3.56 24.17,24.24 v24.17,24.09
CHG-S2  (via drill 0.3)
  Top 0.152: IC6.7 33.63,11.62 v33.79,11.79 | v25.18,24.06 24.67,23.55 IC3.57
  Bottom 0.152: v33.79,11.79 33.79,11.87 33.18,12.48 30.57,12.48 30.29,12.76 30.29,21.88 29.78,22.38 25.61,22.38 25.16,22.84 25.16,24.11 v25.18,24.06
CHGSEL-H  (via drill 0.3)
  Top 0.152: IC6.3 35.7,8.92 35.95,9.18 37.35,9.18 v37.58,8.97 | v31.18,23.98 31.17,23.92 IC3.70
  Bottom 0.152: v37.58,8.97 37.45,8.97 33.62,12.81 30.85,12.81 30.64,13.01 30.64,23.45 v31.18,23.98
CHGSEL-L  (via drill 0.3)
  Top 0.152: IC6.4 35.15,9.48 37.04,9.48 v37.53,9.96 | v30.57,24.75 30.57,23.7 30.67,23.6 IC3.69
  Bottom 0.152: 37.25,9.96 v37.53,9.96 36.89,9.96 33.74,13.11 31.13,13.11 30.97,13.27 30.97,22.79 31.79,23.6 31.79,24.31 31.35,24.75 v30.57,24.75
DCDCPS  (via drill 0.3)
  Top 0.152: IC5.7 44.42,13.38 v45.07,12.73 | v37.98,24.52 37.58,24.93 IC3.77
  Bottom 0.152: v45.07,12.73 46.04,13.7 46.04,21.5 45.73,21.8 39.08,21.8 37.98,22.89 v37.98,24.52
EXT-PWR
  Top 0.152: D1.3 17.57,22.51 R6.2 21.66,22.51 21.66,22.69 IC3.51
GND  (via drill 0.3, 0.61, 0.66, 0.76)
  Top 0.152: IC5.9 C17.2 | IC5.TH v42.41,13.2 v42.4,13.19 | 42.41,14.38 v42.41,14.55 v42.4,14.56 | R11.2 38.59,10.93 36.47,10.93 35.79,11.61 | R10.2 R9.2 34.92,12.48 35.79,11.61 | v33.77,9.56 35.79,11.61 | 43.52,26.49 Q4.2 | C5.2 17.8,45.19 17.8,46.81 18.58,47.58 21.5,47.58 | 21.5,47.58 21.5,43.19 | 21.5,43.19 21.5,42.26 C4.2 | R13.2 | D1.1 14.88,26.47 | 14.88,26.47 SJ2.1 | 14.88,26.47 14.88,28.37 C21.2 16.1,30.59 | C23.2 16.1,30.59 | IC3.41 19.02,28.93 18.78,29.17 18.78,30.59 | 18.78,30.59 16.1,30.59 | IC3.55 23.67,20.67 v23.66,20.56 | IC3.72 32.17,20.48 32.14,20.46 | C18.2 14.58,53.97 16.17,52.38 17.15,52.38 IC1.21 | IC3.31 19,33.93 18.78,33.71 18.78,30.59 | S2.2 45.89,42.75 45.05,43.59 39.6,43.59 | 39.6,43.59 S3.P$GND1 | 39.6,43.59 39.6,41.81 39.64,41.78 | C3.2 21.56,43.12 21.5,43.19 | C2.2 24.93,47.58 | 24.93,47.58 21.5,47.58 | 24.93,47.58 28.33,47.58 28.77,47.14 S3.P$GND2 28.28,43.12 | 28.28,43.12 C19.2 26.15,42.31 26.15,40.75 26.67,40.23 IC3.15 26.67,37.13 26.88,36.91 28.46,36.91 28.67,37.12 IC3.11 | C22.2 15.07,37.73 v14.97,37.83 | S1.4 S1.3 9.95,56.89 11.92,54.92 11.92,54.36 14.24,52.05 v14.24,51.95 | v17.49,51.06 18.23,51.81 | 28.28,43.12 29.07,42.33 v29.07,41.23 | S2.1 37.64,38.11 v39.05,38.11 | v32.65,41.99 32.55,42.09 32.55,42.53
  Top 0.203: 33.82,28.23 33.82,31.86 33.82,34.63 34.12,34.93 IC3.97
  Top 0.254: C16.2 39.64,41.78 37.74,41.78 36.82,42.7 36.82,43.75 35.98,44.58 33.46,44.58 32.55,43.67 32.55,42.53 31.43,41.41 31.43,40.48 S3.P$12 | IC3.41 23.83,28.93 v24.22,29.34 26.61,29.34 v29.96,32.7 | v17.69,45.17 17.72,45.19 17.8,45.19 | v32.93,31.83 32.96,31.86 33.82,31.86
  Top 0.305: IC5.3 IC5.TH | IC5.9 42.41,14.38 | IC6.10 32.13,9.93 | 32.13,9.93 v32.5,9.56 | IC6.11 32.12,9.92 32.13,9.93 | 43.52,26.49 C15.2 R13.2 | 33.82,28.23 34.12,27.93 IC3.83 36.49,27.93 C20.2 R13.2 | Q4.2 v43.67,25.28
  Top 0.406: IC6.21 33.13,8.92 v33.77,8.26
  Top 0.61: v29.04,20.73 29.04,19.77 | v29.17,18.85 29.2,18.88 29.2,19.77 | v28.08,20.76 28.08,20.08 IC2.GND@3 | 16.85,64.14 IC1.13 IC1.22 18.23,51.81 17.66,52.39 IC1.21 | 16.85,64.14 16.06,64.14 C11.2 | C12.- 42.74,22.43 v42.1,23.07 | v16.85,64.78 16.85,64.14
  Top 0.813: IC2.GND@3 29.04,19.77 29.2,19.77 30.48,19.77 C13.- 31.16,20.46 32.14,20.46 C1.2 35.67,20.46 | 35.67,20.46 v35.67,21.09 | v35.67,19.87 35.67,20.46 | C8.2 43.85,19.64 v45.2,19.64 v45.2,20.86 | IC2.GND@2 25.79,5.8 v25.77,5.82
  Top 0.914: C9.2 32.6,1.96 | 32.6,1.96 37,1.96 B1.P- | C6.2 32.57,1.99 32.6,1.96
  Top 1.524: C12.- 43.76,21.77 C8.2 C14.2 43.76,16.73 42.41,15.38 42.41,14.38 IC5.TH 42.41,12.37 43.71,11.07 C7.2 C24.2 C10.2 v43.7,4.12 | v43.7,1.48 v43.7,2.85 | v43.7,2.85 v43.7,4.12 | v43.7,4.12 v42.23,4.12 v42.23,2.85 | v42.23,2.85 42.23,1.43 43.7,1.43 v43.7,2.85 | 32.57,1.99 42.23,1.99 v42.23,2.85
  Bottom 0.152: v23.66,20.56 23.94,20.56 24.14,20.76 | v37.68,13.95 41.79,13.95 v42.4,14.56 | 44.46,24.49 44.64,24.49 | v14.24,51.95 15.12,51.06 v17.49,51.06 | v29.07,41.23 29.83,41.99 v32.65,41.99 | v39.05,38.11 38.85,38.31 38.85,41.99
  Bottom 0.254: v32.65,41.99 38.85,41.99 40.91,41.99 43.32,44.41 45.5,44.41 45.55,44.46 | v17.69,45.17 14.97,42.45 v14.97,37.83
  Bottom 0.305: v43.67,25.28 44.46,24.49
  Bottom 0.406: 23.18,25.69 23.18,28.28 v24.22,29.34
  Bottom 0.457: USB1.5 27.75,6.13 | USB1.5 27.75,2.45 | USB1.5 26.55,4.25 USB1.GND3
  Bottom 0.61: v28.08,20.76 24.14,20.76 23.18,21.72 23.18,25.69 | v42.1,23.07 43.22,23.07 44.64,24.49 45.55,25.41 45.55,34.63 44.79,35.39 44.79,36.58 45.55,37.34 45.55,44.46 45.55,49.16 45.15,49.56 37.3,49.56 35.98,50.88 35.98,64.55 35.44,65.08 17.16,65.08 v16.85,64.78
  Bottom 0.813: v35.67,19.87 35.9,19.64 v45.2,19.64 v45.2,20.86 | 35.67,19.89 v35.67,21.09 | v25.77,5.82 25.77,3.84 26.2,3.4
  Bottom 1.524: 27.75,2.45 27.75,2.06 27.75,1.45 USB1.GND1 | USB1.GND2 32,3.3 USB1.GND1 | USB1.GND3 26.2,3.4 26.1,3.3 USB1.GND4 | USB1.GND1 43.67,1.45 v43.7,1.48 v43.7,4.12 v42.23,4.12 | v42.23,1.45 v42.23,4.12 | v32.5,8.29 v32.5,9.56 v33.77,9.56 v33.77,8.26 33.74,8.29 v32.5,8.29 | v32.5,8.29 34.58,8.29 35.57,7.3 39.05,7.3 v42.23,4.12
  other vias: 25.79,8.01 11.39,52.64 35.52,53.14 35.52,61.02 12.15,22.41 12.15,21.39 12.15,20.38 12.15,19.36 12.15,18.35 12.15,17.33 12.15,16.31 12.15,15.3 12.15,14.28 12.15,13.27 12.15,12.25 12.15,11.23 12.15,10.22 12.15,9.2 12.15,8.19 12.15,7.17 12.15,4.12 12.15,3.11 12.15,2.09 12.15,1.07 16.22,1.07 16.22,4.12 20.79,9.96 25.87,6.92 16.22,14.54 18.25,20.38 24.6,13.77 12.91,5.9 30.95,26.98 23.86,34.47 22.59,36.25 45.2,45.65 33.03,49.41 45.68,8.19 45.68,5.9 25.61,25.97
  pour Top (isolate 0.152, no thermals): -0.04,0.01 14.24,0.01 14.24,10.42 -0.04,10.42
  pour Top (isolate 0.152, no thermals): 30.87,9.94 30.87,9.96 32.07,11.18 32.14,11.18 32.14,9.94
  pour Bottom (isolate 0.152, no thermals): 0.01,0.01 14.24,0.01 14.24,10.42 0.01,10.42
  pour Top (isolate 0.305, rank 3): 47.2,0.31 47.2,46.29 37.81,46.29 36.79,46.29 36.79,66.86 11.39,66.86 11.39,0.06 47.2,0.06
  pour Bottom (isolate 0.305, rank 3): 47.2,0.31 11.64,0.31 11.64,66.86 47.2,66.86
INPUT  (via drill 0.3)
  Top 0.152: IC3.52 22.17,23.87 v22.16,23.96 | v11.52,53.75 9.96,53.75 S1.1 S1.2
  Bottom 0.152: v22.16,23.96 20.41,25.71 20.41,30.66 19.8,31.27 18.15,31.27 12.13,37.29 12.13,53.14 v11.52,53.75
JTAG-TRST  (via drill 0.3)
  Top 0.152: IC3.4 v32.17,36.89 | v43.24,42.81 R1.1
  Bottom 0.152: 32.24,36.81 v32.17,36.89 32.47,36.58 38.72,36.58 43.24,41.1 v43.24,42.81
JTAG_TCK
  Top 0.152: IC3.5 31.67,39 32.42,39.76 S3.P$10
JTAG_TDI
  Top 0.152: IC3.2 33.17,39.39 33.42,39.64 S3.P$8
JTAG_TDO
  Top 0.152: IC3.1 33.67,39.38 33.92,39.63 S3.P$7
JTAG_TMS
  Top 0.152: IC3.3 32.67,39.39 32.92,39.65 S3.P$9
L1
  Top 0.305: IC5.4 40.21,13.38 40.02,13.34
  Top 0.914: 40.02,13.34 39.33,13.34 L1.1
L2
  Top 0.305: IC5.2 40.24,14.38 39.99,14.43
  Top 0.914: 39.99,14.43 39.25,14.43 L1.2
LED-B  (via drill 0.3)
  Top 0.152: v5.55,64.42
  Top 0.203: IC3.32 21.09,33.43 v21.22,33.56 | v5.55,64.42 LED2.4
  Bottom 0.203: v21.22,33.56 17.59,33.56 13.55,37.6 13.55,61.86 10.98,64.42 v5.55,64.42
LED-B-R
  Top 0.305: R19.1 7.92,64.75 LED2.3
LED-G  (via drill 0.3)
  Top 0.152: LED2.6
  Top 0.203: IC3.35 20.97,31.93 v21.19,31.71 | v5.57,61.02 LED2.6
  Bottom 0.203: v21.19,31.71 18.25,31.71 12.66,37.29 12.66,59.67 11.31,61.02 v5.57,61.02
LED-G-R
  Top 0.305: R18.1 7.92,60.69 LED2.1
LED-R  (via drill 0.3)
  Top 0.152: IC3.34 19.93,32.42 | LED2.5
  Top 0.203: 19.93,32.42 20.99,32.42 v21.22,32.65 | v5.57,62.72 LED2.5
  Bottom 0.203: v21.22,32.65 17.89,32.65 13.12,37.45 13.12,60.89 11.29,62.72 v5.57,62.72
LED-R-R
  Top 0.305: R17.1 LED2.2 | LED2.2
N$2
  Top 0.813: 24.65,1.53 25.18,1.53 SJ1.1
  Top 1.524: B1.P+ 21.52,1.53 24.65,1.53
PROG
  Top 0.152: R5.1 16.47,27.48 16.47,25 | 16.47,25 16.47,24.34 16.72,24.09 16.72,21.77 17,21.5 22.54,21.5 22.67,21.62 IC3.53 | SJ2.2 13.49,25 16.47,25
PROG1
  Top 0.152: R10.1 32.35,14.29 32.35,13.11 30.19,10.95 30.19,9.38 30.64,8.92 IC6.13
PROG3
  Top 0.152: R9.1 32.9,13.14 30.52,10.75 30.52,9.63 30.73,9.42 IC6.12
RESET  (via drill 0.3)
  Top 0.152: S2.4 S2.3 | R2.1 37.59,32.34 S2.3 | S2.3 36.54,34.71 36.54,36.63 36.36,36.81 35.14,36.81 34.99,36.96 v34.99,37.17 34.99,38.82 35.42,39.25 S3.P$4 | IC3.17 25.67,37.04 v25.67,36.91
  Bottom 0.152: v25.67,36.91 26.27,37.52 34.63,37.52 v34.99,37.17
RF-GPIO0
  Top 0.152: IC2.GPIO0 27.73,8.39 26.94,8.39 26.58,8.74 26.58,11.87 25.44,13.01 25.44,14.1 24.55,14.99 24.55,18.62 24.12,19.06 24.12,19.72 24.65,20.25 24.65,21.29 25.17,21.81 IC3.58
RF-NIRQ  (via drill 0.3)
  Top 0.152: IC2.NIRQ 26.88,17.23 v26.4,17.71 | IC3.59 25.67,21.8 24.98,21.11 24.98,19.72 v24.7,19.44
  Bottom 0.152: v24.7,19.44 24.7,19.41 v26.4,17.71
RF-NSEL
  Top 0.152: IC2.NSEL 27.28,15.96 25.82,17.43 25.82,18.07 26.25,18.5 26.25,20.48 27.67,21.9 IC3.63
RF-SCLK
  Top 0.152: 27.31,14.69 IC2.SCLK 27.01,14.69 26.4,15.3 26.4,16.11 25.49,17.02 25.49,18.27 25.92,18.7 25.92,20.66 27.17,21.91 IC3.62
RF-SDI  (via drill 0.3)
  Top 0.152: IC2.SDI 26.9,13.5 v26.4,14 | v25.18,15.22 25.18,16.14 24.85,16.47 24.85,18.65 25.28,19.08 25.28,20.91 26.17,21.79 IC3.60
  Bottom 0.152: v25.18,15.22 v26.4,14
RF-SDN
  Top 0.152: IC2.SDN 27.76,18.52 26.96,18.52 26.61,18.88 26.61,20.3 27.8,21.5 28.23,21.5 28.67,21.93 IC3.65
RF-SDO
  Top 0.152: IC2.SDO 26.88,12.15 25.79,13.24 25.79,16.11 25.18,16.72 25.18,18.47 25.59,18.88 25.59,20.76 26.67,21.84 IC3.61
RTCX1
  Top 0.152: IC3.16 26.17,38.98 24.93,40.21 C2.1 25.45,41.42 25.77,41.74 25.77,44.37 Q1.2
RTCX2
  Top 0.152: IC3.18 25.17,38.98 22.9,41.26 C3.1 23.42,41.42 23.89,41.89 23.89,44.56 23.07,45.38 Q1.1
RX
  Top 0.152: TP2.TP 34.92,42.72 S3.P$5 34.92,39.64 34.4,39.12 34.4,36.05 34.53,35.93 IC3.99
SCL-EXT  (via drill 0.3)
  Top 0.152: S3.P$3 35.92,38.79 v35.77,38.64 | v20.94,38.82 21.37,39.25 21.86,39.25 22.17,38.94 IC3.24
  Bottom 0.152: v35.77,38.64 35.39,38.26 21.5,38.26 v20.94,38.82
SDA-EXT  (via drill 0.3)
  Top 0.152: S3.P$2 36.42,38.07 v35.98,37.62 | 21.68,38.17 IC3.25 21.37,37.88 v21.02,37.88
  Bottom 0.152: v35.98,37.62 35.72,37.88 v21.02,37.88
THERM
  Top 0.152: IC6.5 36.09,9.92 36.77,10.6 37.76,10.6 38.16,10.19 38.16,9.15 38.52,8.8 38.77,8.8 R11.1
TX
  Top 0.152: TP1.TP 34.42,42.66 S3.P$6 34.42,39.65 34.07,39.3 34.07,35.85 34.49,35.43 IC3.98
USB-CABLE-D+  (via drill 0.3)
  Top 0.152: v13.65,33.69 14.29,34.32 R4.1 15.15,34.74 R15.2
  Bottom 0.152: USB1.3 29.05,7.9 27.9,9.05 26.71,9.05 13.09,22.66 13.09,33.13 v13.65,33.69
USB-CABLE-D-  (via drill 0.3)
  Top 0.152: v14.67,33.66 R16.2
  Bottom 0.152: USB1.2 29.7,7.88 28.15,9.43 26.86,9.43 13.45,22.84 13.45,32.44 v14.67,33.66
USB-CON  (via drill 0.3)
  Top 0.152: 1K.1 19.34,38.22 v19.34,37.12 | v28.15,25.03 28.17,25.01 IC3.64
  Bottom 0.152: v19.34,37.12 23.25,37.12 28.15,32.21 v28.15,25.03
USB-CON-TRANS
  Top 0.152: 1K.2 14.97,39.76 IC4.1
USB-CON-TRANS-2
  Top 0.152: IC4.3 14.29,37.29 R4.2
USB-D+
  Top 0.152: IC3.29 18.57,34.93 R15.1 C22.1
USB-D-
  Top 0.152: IC3.30 18.57,34.43 R16.1 C23.1
V+  (via drill 0.3)
  Top 0.152: Q3.2 43.69,31.52 R14.1 | 25.41,3.87 25.82,3.87 | 31.41,8.42 30.61,8.42 29.48,9.56 v29.48,9.89 | 43.64,31.77 Q3.2 | v41.97,31.96 43.25,31.96 Q3.2
  Top 0.305: IC6.15 30.91,7.92 30.8,7.8 | IC6.14 31.41,8.42 31.41,7.96 31.16,7.96 IC6.15 | IC6.16 31.16,6.96 IC6.15
  Top 0.813: SJ1.2 25.4,3.45 25.77,3.82
  Top 0.914: C9.1 27.57,3.71 27.72,3.87
  Top 1.524: 25.77,3.82 25.82,3.87 27.72,3.87 28.92,3.87 30.34,5.29 30.34,7.35 30.8,7.8
  Bottom 0.152: v29.48,9.89 30.97,11.39 31.79,11.39 31.96,11.21 34.68,11.21 36.89,8.97 36.89,8.72 37.22,8.39 37.96,8.39 38.19,8.62 38.19,10.17 37.73,10.62 36.66,10.62 34.56,12.73 34.56,22.46 37.4,25.31 38.47,25.31 40.04,23.73 41.36,23.73 41.97,24.34 v41.97,31.96
VCC  (via drill 0.3)
  Top 0.152: IC5.8 44.45,13.88 44.92,13.42 45.43,13.42 45.68,13.16 45.68,12.38 45.43,12.12 45.1,12.12 | IC5.6 44.64,12.12 45.1,12.12 | IC5.5 40.94,10.6 v41.97,10.6 | v45.1,11.21 45.1,12.12
  Top 0.254: 40.93,12.55 40.94,12.25 IC5.5
  Top 0.305: IC6.20 34.15,7.07 34.38,6.99 | IC6.1 34.89,7.92 34.89,6.99 | 35.44,7.3 35.42,7.3 35.42,6.99 | C7.1 40.93,10.6
  Top 0.813: 34.38,6.99 34.89,6.99 35.42,6.99 35.67,6.99
  Top 0.914: 40.93,10.6 40.93,12.55
  Top 1.524: 35.44,7.3 40.71,7.3 | C10.1 40.71,7.3 | 40.71,7.3 C24.1 C7.1
  Bottom 0.152: v41.97,10.6 44.49,10.6 v45.1,11.21
VDD
  Top 0.61: Q5.3 14.73,58.87 12.51,61.09 12.51,63.84 13.86,65.18 C11.1 14.82,65.89 19.85,65.89 20.41,65.34 IC1.12
VEE
  Top 0.813: IC2.VCC 28.97,10.88 30.08,12 30.08,13.39 30.58,13.89 C13.+ 30.58,15.95 32.09,17.46 C1.1 35.06,18.68 Q6.3
XTAL1
  Top 0.152: IC3.22 23.17,39.08 21.37,40.88 19.9,40.88 19.33,41.45 C4.1 19.32,41.79 18.35,42.75 18.35,44.75 Q2.3
XTAL2
  Top 0.152: Q2.1 15.48,42.41 C5.1 16.97,40.93 19.26,40.93 19.62,40.57 21.17,40.57 22.67,39.07 IC3.23

### Text on the board
Top: SkyNet / v3.1 i7 | q2: 2 freie pins | +